# EAGLE design control (EAGLE 9.5.1)
COMPANY: PepeTech; CREVISION: V1.0; DESIGNER: Rafael Silva; LICENSE: Licensed under GNU General Public License v3.0; LINK: https://github.com/pepetech/r3eflow-oven
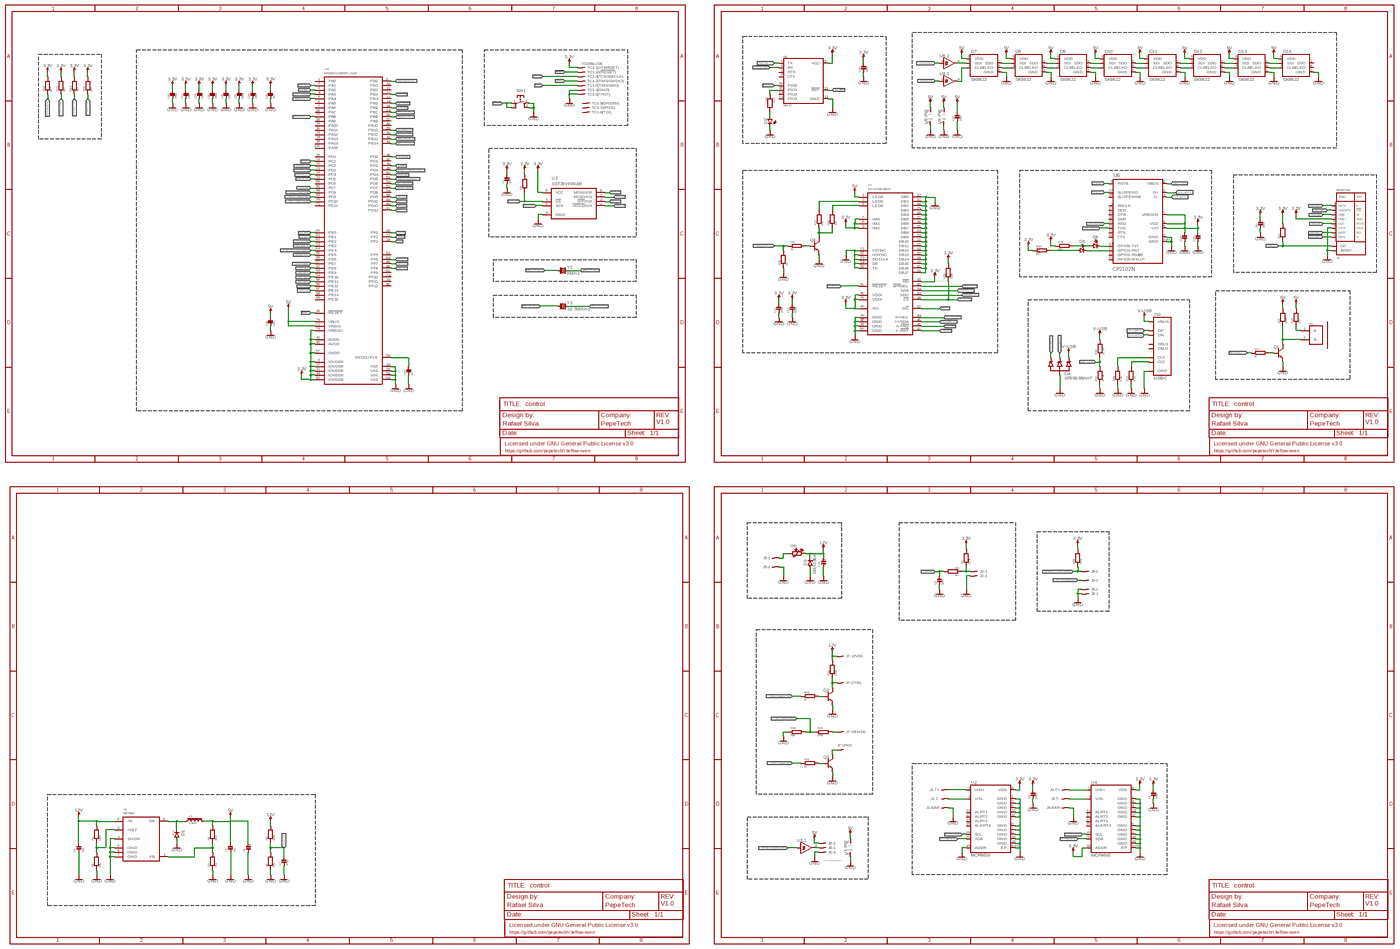
[diagram p0: schematic, sheet 1, overview]
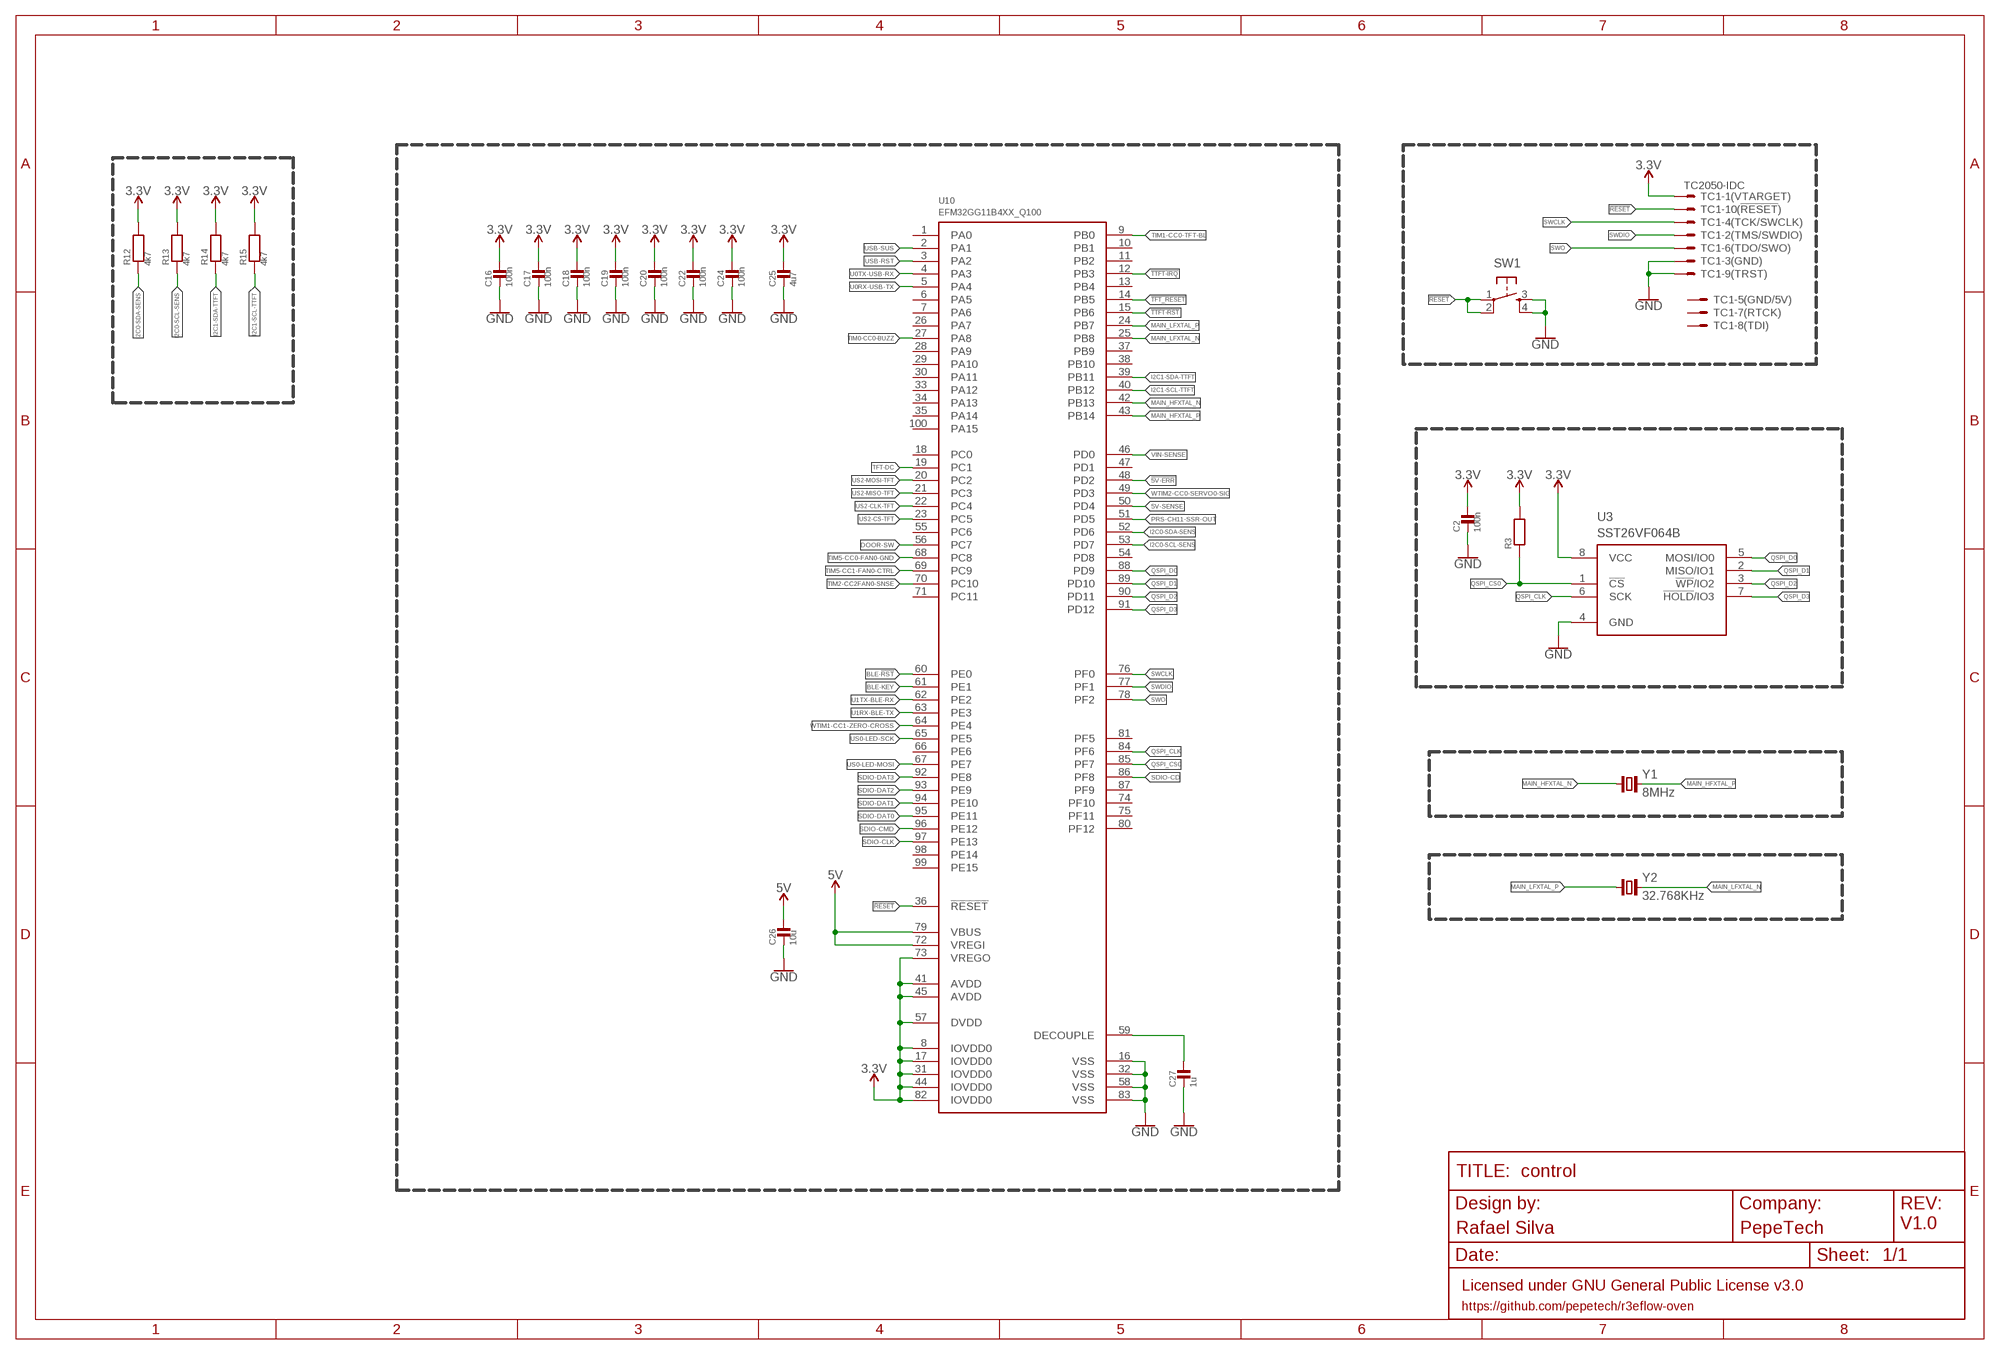
[diagram p1: schematic, sheet 1, part 1 of 4]
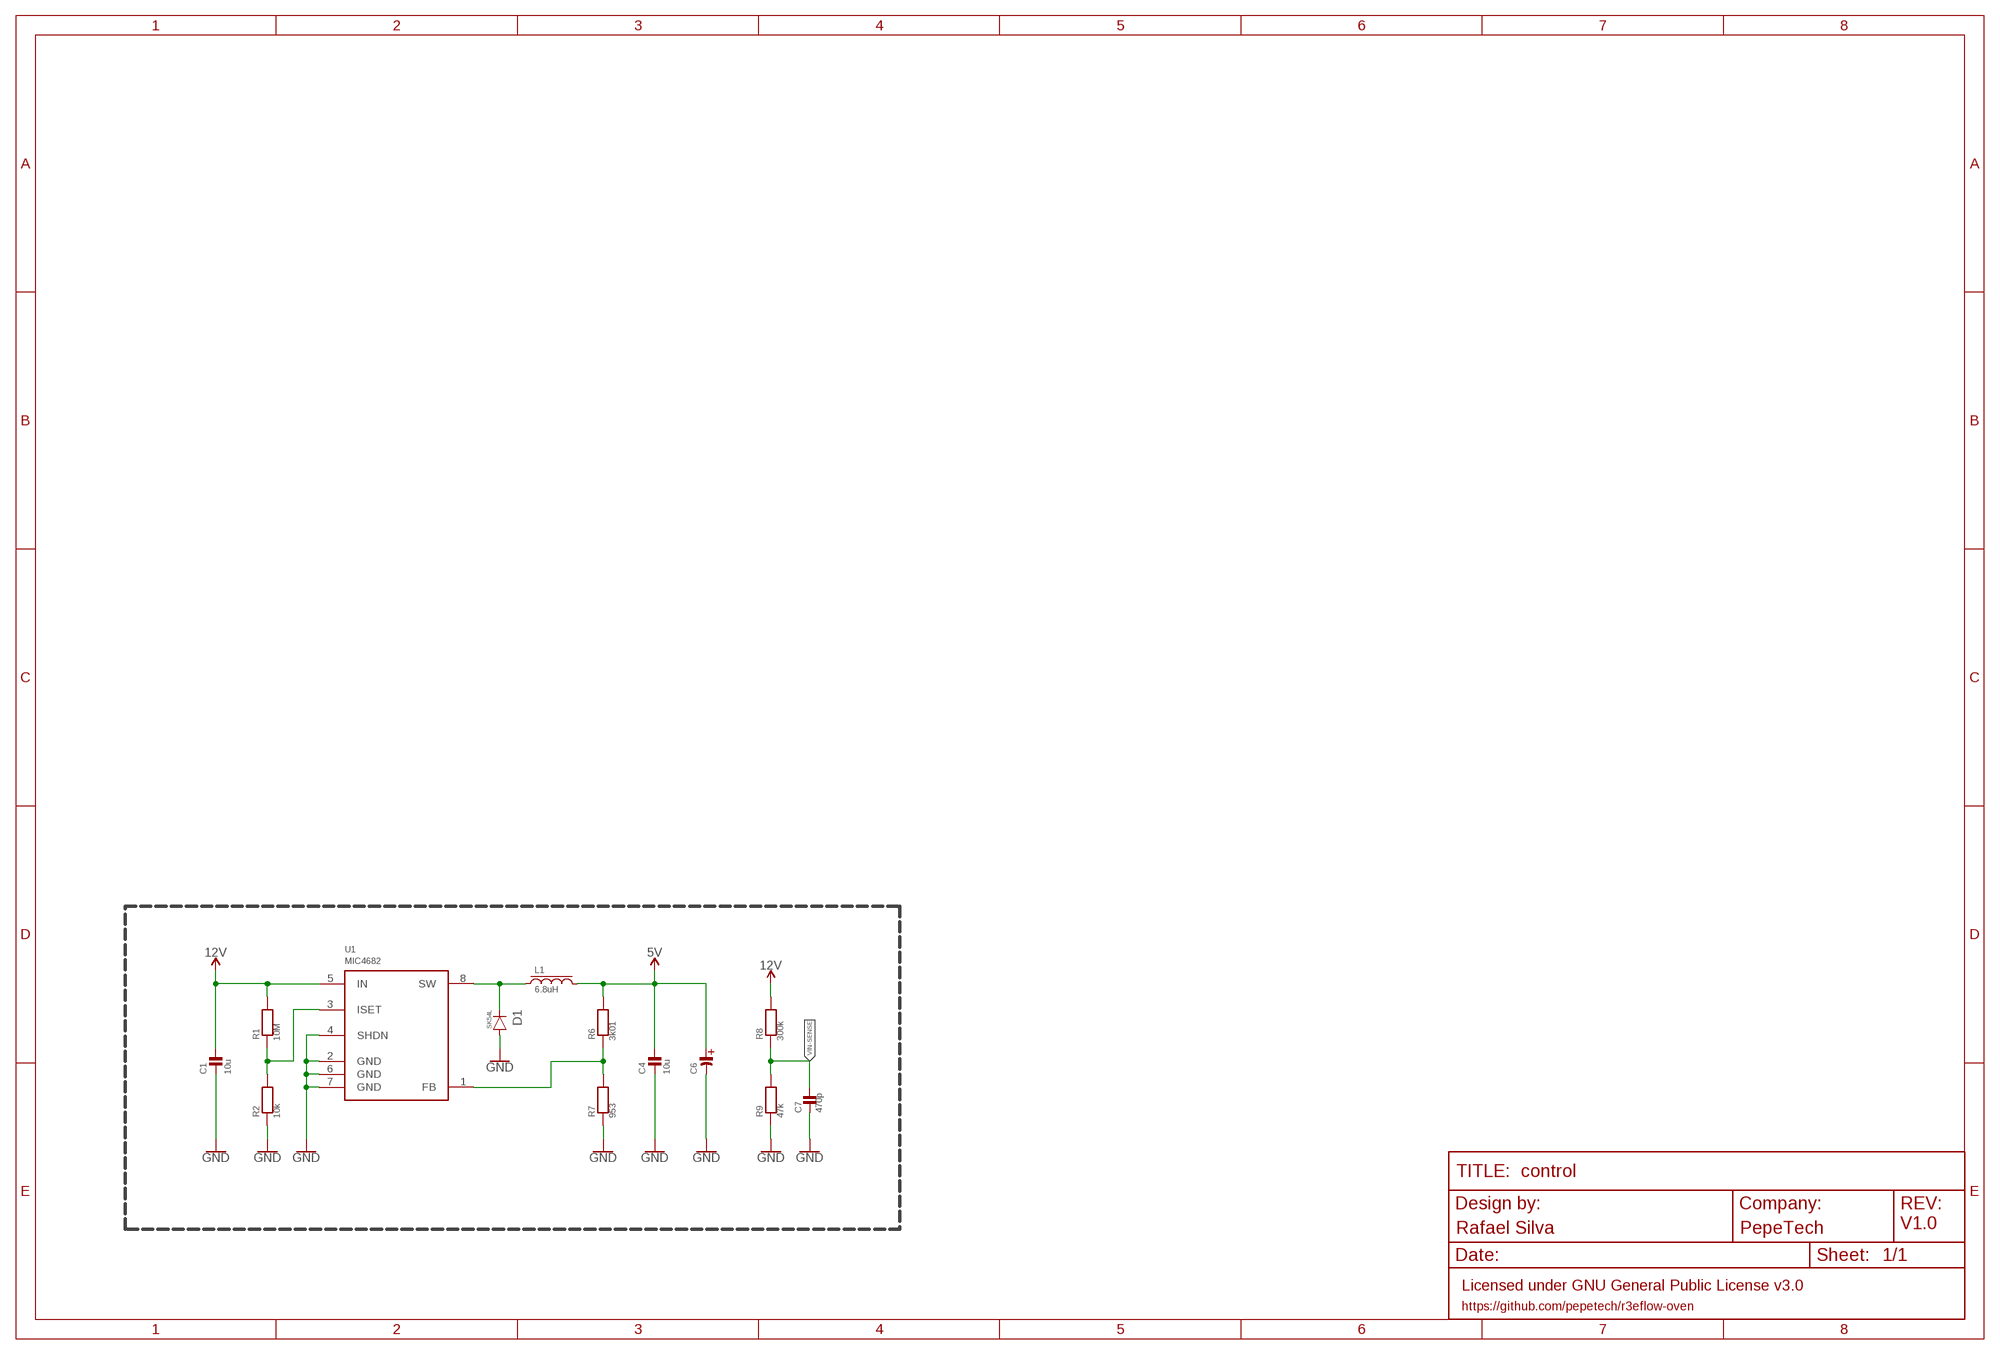
[diagram p2: schematic, sheet 1, part 2 of 4]
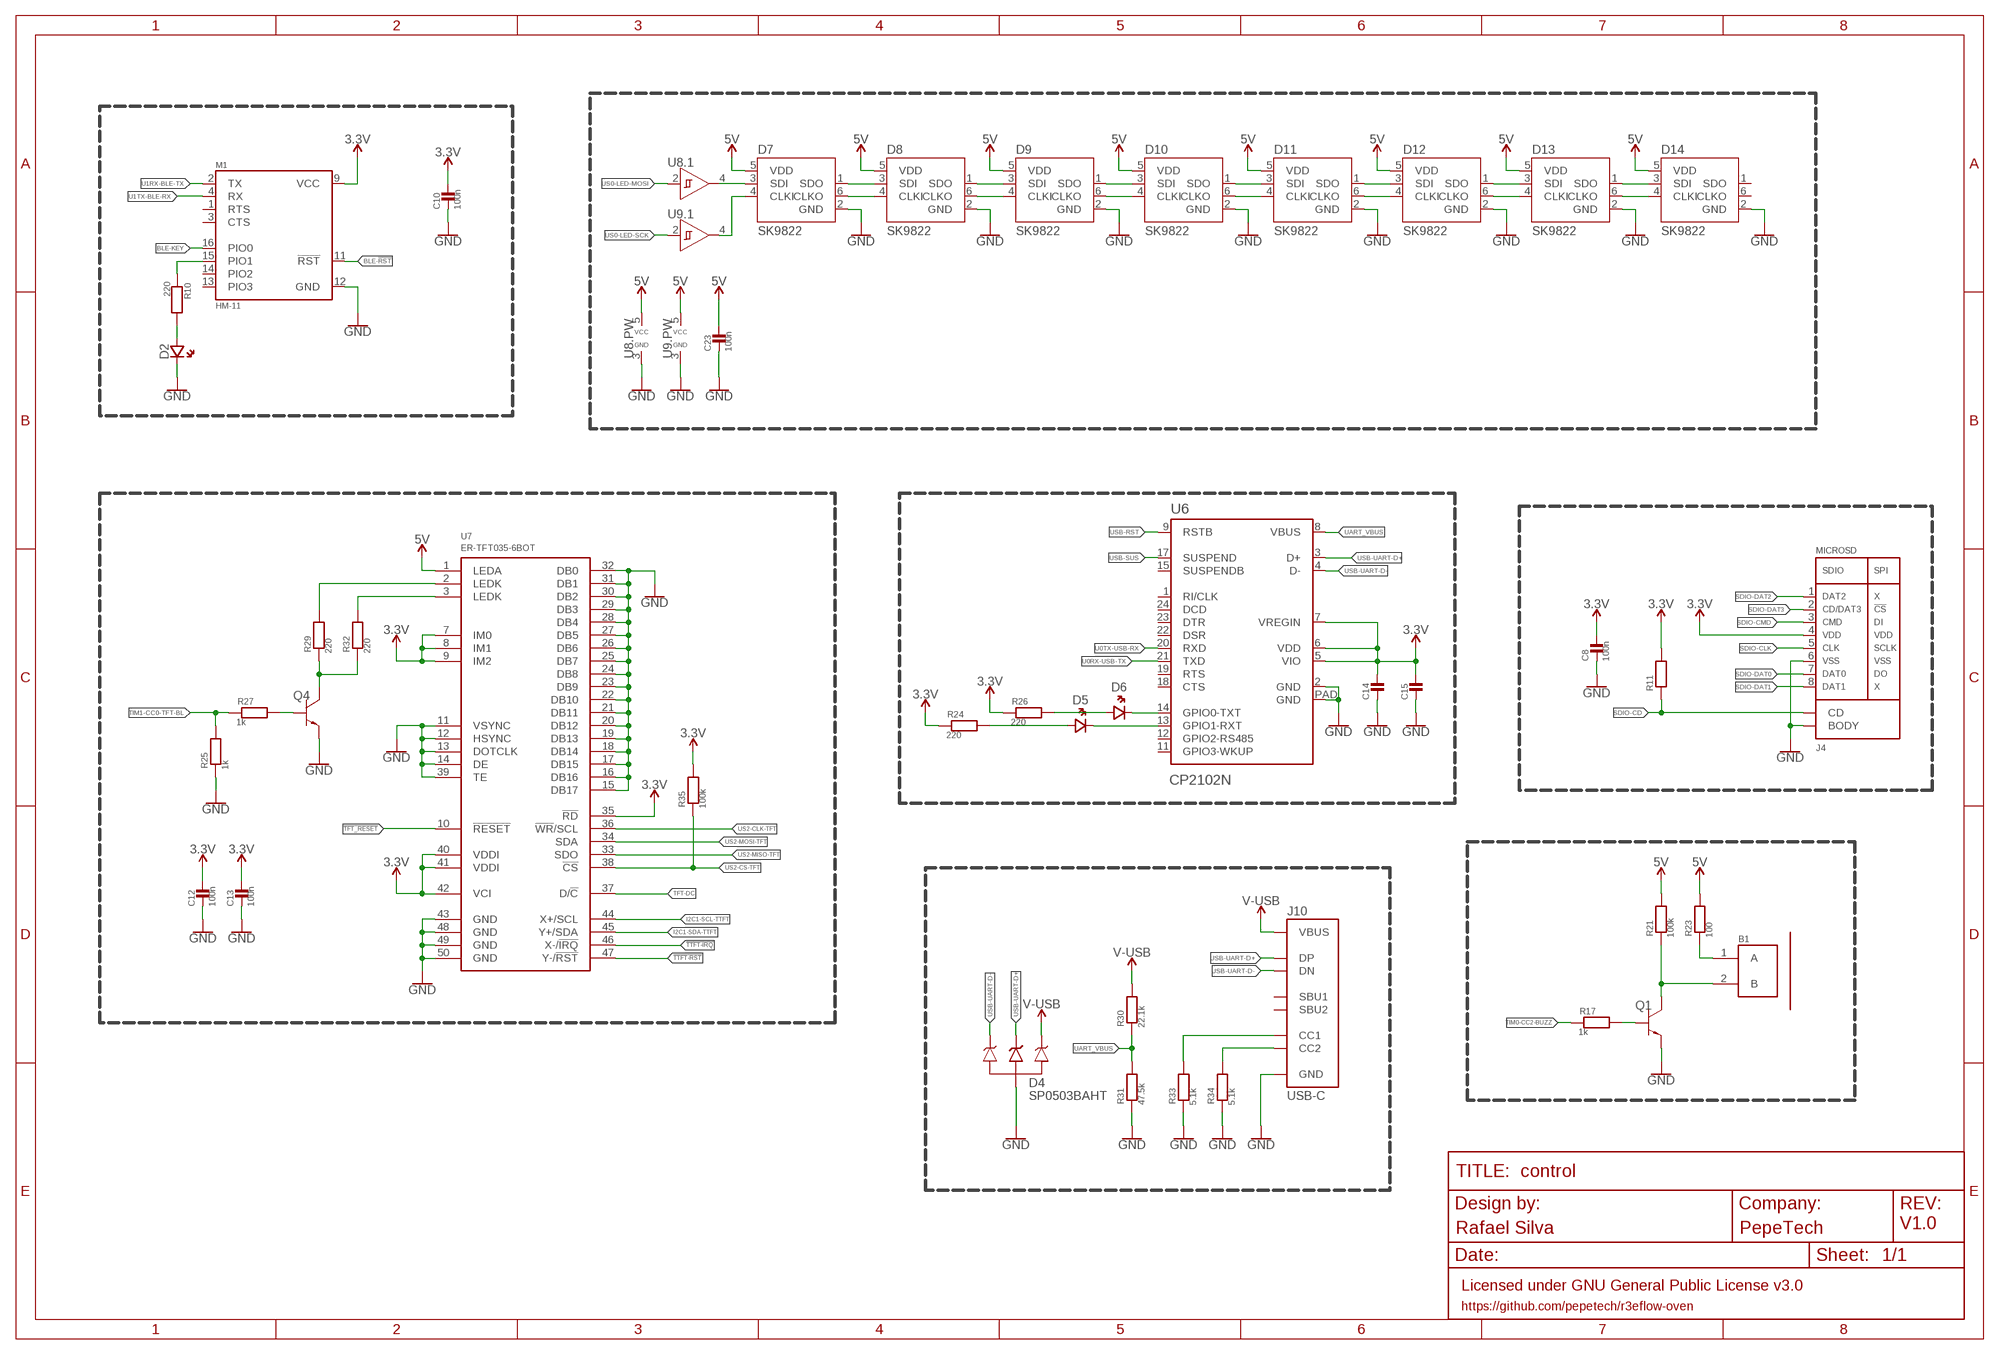
[diagram p3: schematic, sheet 1, part 3 of 4]
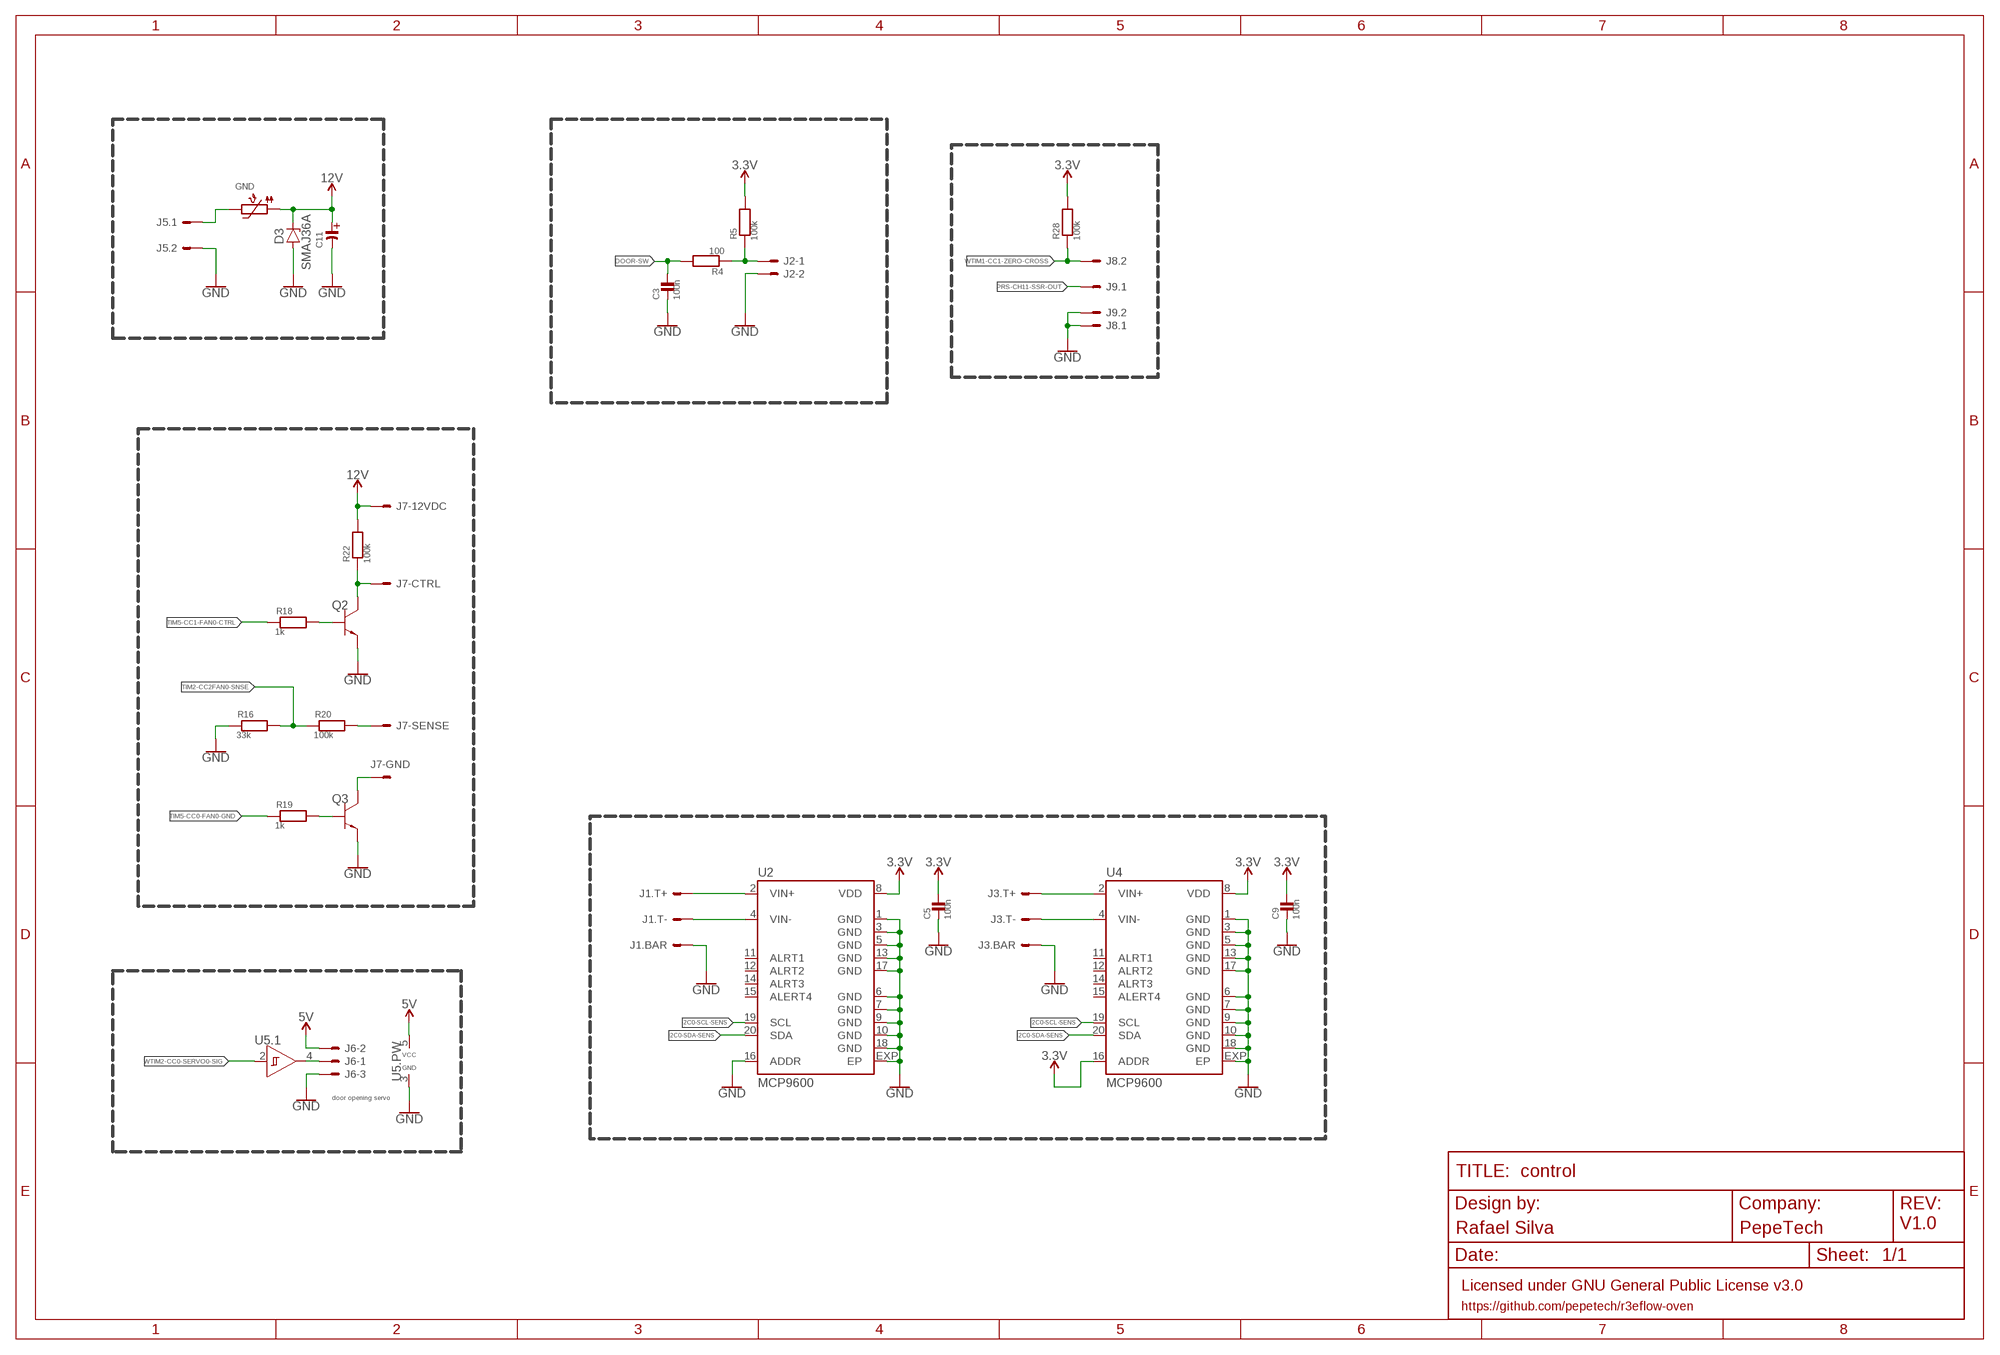
[diagram p4: schematic, sheet 1, part 4 of 4]

## Parts
B1  PKLCS1212E2400-R1  [BUZZ_PIEZO_SMD]
C1  10u  MLCC0603_MINI  [0603-MINI]
C2  100n  MLCC0603  [0603_WAVE]
C3  100n  MLCC0603  [0603_WAVE]
C4  10u  MLCC0603_MINI  [0603-MINI]
C5  100n  MLCC0603  [0603_WAVE]
C6  220u  CAPACITOR_ELD  [PANASONIC_D]
C7  470p  MLCC0603  [0603_WAVE]
C8  100n  MLCC0603  [0603_WAVE]
C9  100n  MLCC0603  [0603_WAVE]
C10  100n  MLCC0603  [0603_WAVE]
C11  CAPACITOR_ELD  [PANASONIC_D]
C12  100n  MLCC0603  [0603_WAVE]
C13  100n  MLCC0603  [0603_WAVE]
C14  MLCC0603  [0603_WAVE]
C15  MLCC0603  [0603_WAVE]
C16  100n  MLCC0603  [0603_WAVE]
C17  100n  MLCC0603  [0603_WAVE]
C18  100n  MLCC0603  [0603_WAVE]
C19  100n  MLCC0603  [0603_WAVE]
C20  100n  MLCC0603  [0603_WAVE]
C22  100n  MLCC0603  [0603_WAVE]
C23  100n  MLCC0603  [0603_WAVE]
C24  100n  MLCC0603  [0603_WAVE]
C25  4u7  MLCC0603  [0603_WAVE]
C26  10u  MLCC0603  [0603_WAVE]
C27  1u  MLCC0603  [0603_WAVE]
D1  SK54L  [DO214AA]
D2  LED0603  [CHIPLED_0603]
D3  SMAJ36A  [DO214AC]
D4  SP0503BAHT  [SOT143]
D5  LED0603  [CHIPLED_0603]
D6  LED0603  [CHIPLED_0603]
D7  SK9822  [2020]
D8  SK9822  [2020]
D9  SK9822  [2020]
D10  SK9822  [2020]
D11  SK9822  [2020]
D12  SK9822  [2020]
D13  SK9822  [2020]
D14  SK9822  [2020]
GND  PTC1812  [PTC1812]
J1  PCC-SMP  [PCC-SMP]
J2  2X1_2.54  [2X1_2.54]
J3  PCC-SMP  [PCC-SMP]
J4  MICROSD  [MICRO-SD]
J5  2EDG-2P  [2EDG-2P]
J6  3X1_2.54  [3X1_2.54]
J7  4P-PC-FAN  [KF2510-3+1P]
J8  2EDG-2P  [2EDG-2P]
J9  2EDG-2P  [2EDG-2P]
J10  USB-C  [USB-C]
L1  6.8uH  INDUCTOR_1207  [_1207]
M1  HM-11  [HM-11]
Q1  BC817-40  [SOT-23-3]
Q2  BC817-40  [SOT-23-3]
Q3  BC817-40  [SOT-23-3]
Q4  BC817-40  [SOT-23-3]
R1  10M  RESISTOR0603  [0603_WAVE]
R2  10k  RESISTOR0603  [0603_WAVE]
R3  RESISTOR0603  [0603_WAVE]
R4  100  RESISTOR0603  [0603_WAVE]
R5  100k  RESISTOR0603  [0603_WAVE]
R6  3k01  RESISTOR0603  [0603_WAVE]
R7  953  RESISTOR0603  [0603_WAVE]
R8  300k  RESISTOR0603  [0603_WAVE]
R9  47k  RESISTOR0603  [0603_WAVE]
R10  220  RESISTOR0603  [0603_WAVE]
R11  RESISTOR0603  [0603_WAVE]
R12  4k7  RESISTOR0603  [0603_WAVE]
R13  4k7  RESISTOR0603  [0603_WAVE]
R14  4k7  RESISTOR0603  [0603_WAVE]
R15  4k7  RESISTOR0603  [0603_WAVE]
R16  33k  RESISTOR0603  [0603_WAVE]
R17  1k  RESISTOR0603  [0603_WAVE]
R18  1k  RESISTOR0603  [0603_WAVE]
R19  1k  RESISTOR0603  [0603_WAVE]
R20  100k  RESISTOR0603  [0603_WAVE]
R21  100k  RESISTOR0603  [0603_WAVE]
R22  100k  RESISTOR0603  [0603_WAVE]
R23  100  RESISTOR0603  [0603_WAVE]
R24  220  RESISTOR0603  [0603_WAVE]
R25  1k  RESISTOR0603  [0603_WAVE]
R26  220  RESISTOR0603  [0603_WAVE]
R27  1k  RESISTOR0603  [0603_WAVE]
R28  100k  RESISTOR0603  [0603_WAVE]
R29  220  RESISTOR0603  [0603_WAVE]
R30  22.1k  RESISTOR0603  [0603_WAVE]
R31  47.5k  RESISTOR0603  [0603_WAVE]
R32  220  RESISTOR0603  [0603_WAVE]
R33  5.1k  RESISTOR0603  [0603_WAVE]
R34  5.1k  RESISTOR0603  [0603_WAVE]
R35  100k  RESISTOR0603  [0603_WAVE]
SW1  PUSH_BUTTON  [PUSH_BUTTON]
TC1  TC2050-IDC  [TC2050-IDC]
U1  MIC4682  [SOIC8]
U2  MCP9600  [TQFN20-5X5]
U3  SST26VF064B  [WSOIC8]
U4  MCP9600  [TQFN20-5X5]
U5  74LVC1G17  [SC70-5]
U6  CP2102N  [QFN24]
U7  ER-TFT035-6BOT  [ZIF50-TFT_BACK]
U8  74LVC1G17  [SC70-5]
U9  74LVC1G17  [SC70-5]
U10  EFM32GG11B4XX_Q100  [QFP100]
Y1  8MHz  CRYSTALNX5032GA  [2-SMD-5X3]
Y2  32.768KHz  CRYSTALCM200S  [CM200S]

## Nets
3.3V: C2.P$1 C5.P$1 C8.P$1 C9.P$1 C10.P$1 C12.P$1 C13.P$1 C14.P$1 C15.P$1 C16.P$1 C17.P$1 C18.P$1 C19.P$1 C20.P$1 C22.P$1 C24.P$1 C25.P$1 J4.4 M1.9(VCC) R3.P$2 R5.P$2 R11.P$2 R12.P$2 R13.P$2 R14.P$2 R15.P$2 R24.P$1 R26.P$1 R28.P$2 R35.P$2 TC1.1 U2.8(VDD) U3.8(VCC) U4.8(VDD) U4.16(ADDR) U6.5(VIO) U6.6(VDD) U6.7(VREGIN) U7.7(IM0) U7.8(IM1) U7.9(IM2) U7.35(!RD) U7.40(VDDI) U7.41(VDDI) U7.42(VCI) U10.8(IOVDD0) U10.17(IOVDD0) U10.31(IOVDD0) U10.41(AVDD) U10.44(IOVDD0) U10.45(AVDD) U10.57(DVDD) U10.73(VREGO) U10.82(IOVDD0)
5V: C4.1 C6.+(AN) C23.P$1 C26.P$1 D7.5(VDD) D8.5(VDD) D9.5(VDD) D10.5(VDD) D11.5(VDD) D12.5(VDD) D13.5(VDD) D14.5(VDD) J6.P$2 L1.2 R6.P$2 R21.P$2 R23.P$2 U5.5(.PW:VCC) U7.1(LEDA) U8.5(.PW:VCC) U9.5(.PW:VCC) U10.72(VREGI) U10.79(VBUS)
5V-SENSE: U10.50(PD4)
12V: C1.1 C11.+(AN) D3.C GND.P$1 J7.2 R1.P$2 R8.P$2 R22.P$2 U1.5(IN)
!5V-ERR: U10.48(PD2)
!RESET: SW1.1 SW1.2 TC1.10 U10.36(!RESET)
!TFT_RESET: U7.10(!RESET) U10.14(PB5)
!TTFT-IRQ: U7.46(X-/!IRQ!) U10.12(PB3)
!TTFT-RST: U7.47(Y-/!RST!) U10.15(PB6)
BLE-!RST: M1.11(!RST!) U10.60(PE0)
BLE-KEY: M1.16(PIO0) U10.61(PE1)
DECOUPLE: C27.P$1 U10.59(DECOUPLE)
DOOR-SW: C3.P$1 R4.P$2 U10.56(PC7)
GND: C1.2 C2.P$2 C3.P$2 C4.2 C5.P$2 C6.-(CA) C7.P$2 C8.P$2 C9.P$2 C10.P$2 C11.-(CA) C12.P$2 C13.P$2 C14.P$2 C15.P$2 C16.P$2 C17.P$2 C18.P$2 C19.P$2 C20.P$2 C22.P$2 C23.P$2 C24.P$2 C25.P$2 C26.P$2 C27.P$2 D1.A D2.C(CA) D3.A D4.1 D7.2(GND) D8.2(GND) D9.2(GND) D10.2(GND) D11.2(GND) D12.2(GND) D13.2(GND) D14.2(GND) J1.3-BAR J1.4-BAR J2.2 J3.3-BAR J3.4-BAR J4.6 J4.BODY1(BODY) J4.BODY2(BODY) J4.BODY3(BODY) J4.BODY4(BODY) J5.P$2 J6.P$3 J8.P$1 J9.P$2 J10.A1_B12(GND) J10.B1_A12(GND) J10.SHIELD0(GND) J10.SHIELD1(GND) J10.SHIELD2(GND) J10.SHIELD3(GND) M1.12(GND) Q1.P$2(EM2) Q2.P$2(EM2) Q3.P$2(EM2) Q4.P$2(EM2) R2.P$1 R7.P$1 R9.P$1 R16.P$1 R25.P$1 R31.P$1 R33.P$1 R34.P$1 SW1.3 SW1.4 TC1.3 TC1.9 U1.2(GND) U1.4(SHDN) U1.6(GND) U1.7(GND) U2.1(GND) U2.3(GND) U2.5(GND) U2.6(GND) U2.7(GND) U2.9(GND) U2.10(GND) U2.13(GND) U2.16(ADDR) U2.17(GND) U2.18(GND) U2.EXP(EP) U3.4(GND) U4.1(GND) U4.3(GND) U4.5(GND) U4.6(GND) U4.7(GND) U4.9(GND) U4.10(GND) U4.13(GND) U4.17(GND) U4.18(GND) U4.EXP(EP) U5.3(.PW:GND) U6.2(GND) U6.PAD(GND) U7.11(VSYNC) U7.12(HSYNC) U7.13(DOTCLK) U7.14(DE) U7.15(DB17) U7.16(DB16) U7.17(DB15) U7.18(DB14) U7.19(DB13) U7.20(DB12) U7.21(DB11) U7.22(DB10) U7.23(DB9) U7.24(DB8) U7.25(DB7) U7.26(DB6) U7.27(DB5) U7.28(DB4) U7.29(DB3) U7.30(DB2) U7.31(DB1) U7.32(DB0) U7.39(TE) U7.43(GND) U7.48(GND) U7.49(GND) U7.50(GND) U8.3(.PW:GND) U9.3(.PW:GND) U10.16(VSS) U10.32(VSS) U10.58(VSS) U10.83(VSS)
I2C0-SCL-SENS: R13.P$1 U2.19(SCL) U4.19(SCL) U10.53(PD7)
I2C0-SDA-SENS: R12.P$1 U2.20(SDA) U4.20(SDA) U10.52(PD6)
I2C1-SCL-TTFT: R15.P$1 U7.44(X+/SCL) U10.40(PB12)
I2C1-SDA-TTFT: R14.P$1 U7.45(Y+/SDA) U10.39(PB11)
MAIN_HFXTAL_N: U10.42(PB13) Y1.1
MAIN_HFXTAL_P: U10.43(PB14) Y1.2
MAIN_LFXTAL_N: U10.25(PB8) Y2.4
MAIN_LFXTAL_P: U10.24(PB7) Y2.1
N$1: J2.1 R4.P$1 R5.P$1
N$2: J6.P$1 U5.4(.1:Y)
N$3: J10.B5(CC2) R34.P$2
N$4: B1.1(A) R23.P$1
N$5: J10.A5(CC1) R33.P$2
N$6: D7.1(SDO) D8.3(SDI)
N$7: D7.4(CLKI) U9.4(.1:Y)
N$8: D7.3(SDI) U8.4(.1:Y)
N$9: D7.6(CLKO) D8.4(CLKI)
N$10: D8.1(SDO) D9.3(SDI)
N$11: D8.6(CLKO) D9.4(CLKI)
N$12: D9.1(SDO) D10.3(SDI)
N$13: D5.C(CA) U6.13(GPIO1-RXT)
N$14: D9.6(CLKO) D10.4(CLKI)
N$15: D6.C(CA) U6.14(GPIO0-TXT)
N$16: D6.A(AN) R26.P$2
N$17: B1.2(B) Q1.P$3(C03) R21.P$1
N$18: Q1.P$1(BA1) R17.P$2
N$19: D5.A(AN) R24.P$2
N$20: D10.1(SDO) D11.3(SDI)
N$21: D10.6(CLKO) D11.4(CLKI)
N$22: D11.1(SDO) D12.3(SDI)
N$23: D11.6(CLKO) D12.4(CLKI)
N$24: D12.1(SDO) D13.3(SDI)
N$25: Q4.P$1(BA1) R27.P$2
N$26: D12.6(CLKO) D13.4(CLKI)
N$27: D13.1(SDO) D14.3(SDI)
N$28: D13.6(CLKO) D14.4(CLKI)
N$30: GND.P$2 J5.P$1
N$31: D1.C L1.1 U1.8(SW)
N$32: R6.P$1 R7.P$2 U1.1(FB)
N$34: R1.P$1 R2.P$2 U1.3(ISET)
N$35: D2.A(AN) R10.P$2
N$36: M1.15(PIO1) R10.P$1
N$56: Q3.P$1(BA1) R19.P$2
N$57: J7.1 Q3.P$3(C03)
N$58: Q2.P$1(BA1) R18.P$2
N$59: J7.4 Q2.P$3(C03) R22.P$1
N$64: J7.3 R20.P$2
PRS-CH11-SSR-OUT: J9.P$1 U10.51(PD5)
QSPI_CLK: U3.6(SCK) U10.84(PF6)
QSPI_CS0: R3.P$1 U3.1(!CS!) U10.85(PF7)
QSPI_D0: U3.5(MOSI/IO0) U10.88(PD9)
QSPI_D1: U3.2(MISO/IO1) U10.89(PD10)
QSPI_D2: U3.3(!WP!/IO2) U10.90(PD11)
QSPI_D3: U3.7(!HOLD!/IO3) U10.91(PD12)
SDIO-CD: J4.9(CD) R11.P$1 U10.86(PF8)
SDIO-CLK: J4.5 U10.97(PE13)
SDIO-CMD: J4.3 U10.96(PE12)
SDIO-DAT0: J4.7 U10.95(PE11)
SDIO-DAT1: J4.8 U10.94(PE10)
SDIO-DAT2: J4.1 U10.93(PE9)
SDIO-DAT3: J4.2 U10.92(PE8)
SWCLK: TC1.4 U10.76(PF0)
SWDIO: TC1.2 U10.77(PF1)
SWO: TC1.6 U10.78(PF2)
TC_VIN0+: J1.1-T+ U2.2(VIN+)
TC_VIN0-: J1.2-T- U2.4(VIN-)
TC_VIN1+: J3.1-T+ U4.2(VIN+)
TC_VIN1-: J3.2-T- U4.4(VIN-)
TFT-DC: U7.37(D/!C!) U10.19(PC1)
TFT-LEDK: Q4.P$3(C03) R29.P$1 R32.P$1
TFT-LEDK1: R29.P$2 U7.2(LEDK)
TFT-LEDK2: R32.P$2 U7.3(LEDK)
TIM0-CC0-BUZZ: U10.27(PA8)
TIM0-CC2-BUZZ: R17.P$1
TIM1-CC0-TFT-BL: R25.P$2 R27.P$1 U10.9(PB0)
TIM2-CC2FAN0-SNSE: R16.P$2 R20.P$1 U10.70(PC10)
TIM5-CC0-FAN0-GND: R19.P$1 U10.68(PC8)
TIM5-CC1-FAN0-CTRL: R18.P$1 U10.69(PC9)
U0RX-USB-TX: U6.21(TXD) U10.5(PA4)
U0TX-USB-RX: U6.20(RXD) U10.4(PA3)
U1RX-BLE-TX: M1.2(TX) U10.63(PE3)
U1TX-BLE-RX: M1.4(RX) U10.62(PE2)
UART_VBUS: R30.P$1 R31.P$2 U6.8(VBUS)
US0-LED-MOSI: U8.2(.1:A) U10.67(PE7)
US0-LED-SCK: U9.2(.1:A) U10.65(PE5)
US2-CLK-TFT: U7.36(!WR!/SCL) U10.22(PC4)
US2-CS-TFT: R35.P$1 U7.38(!CS) U10.23(PC5)
US2-MISO-TFT: U7.33(SDO) U10.21(PC3)
US2-MOSI-TFT: U7.34(SDA) U10.20(PC2)
USB-RST: U6.9(RSTB) U10.3(PA2)
USB-SUS: U6.17(SUSPEND) U10.2(PA1)
USB-UART-D+: D4.3 J10.A6(DP) J10.B6(DP) U6.3(D+)
USB-UART-D-: D4.2 J10.A7(DN) J10.B7(DN) U6.4(D-)
V_USB: D4.4 J10.A4_B9(VBUS) J10.B4_A9(VBUS) R30.P$2 ; supply symbol labelled V-USB
VIN-SENSE: C7.P$1 R8.P$1 R9.P$2 U10.46(PD0)
WTIM1-CC1-ZERO-CROSS: J8.P$2 R28.P$1 U10.64(PE4)
WTIM2-CC0-SERVO0-SIG: U5.2(.1:A) U10.49(PD3)
Unconnected: D14.1(SDO) D14.6(CLKO) J10.A8(SBU1) J10.B8(SBU2) M1.1(RTS) M1.3(CTS) M1.13(PIO3) M1.14(PIO2) TC1.5 TC1.7 TC1.8 U2.11(ALRT1) U2.12(ALRT2) U2.14(ALRT3) U2.15(ALERT4) U4.11(ALRT1) U4.12(ALRT2) U4.14(ALRT3) U4.15(ALERT4) U6.1(RI/CLK) U6.11(GPIO3-WKUP) U6.12(GPIO2-RS485) U6.15(SUSPENDB) U6.18(CTS) U6.19(RTS) U6.22(DSR) U6.23(DTR) U6.24(DCD) U10.1(PA0) U10.6(PA5) U10.7(PA6) U10.10(PB1) U10.11(PB2) U10.13(PB4) U10.18(PC0) U10.26(PA7) U10.28(PA9) U10.29(PA10) U10.30(PA11) U10.33(PA12) U10.34(PA13) U10.35(PA14) U10.37(PB9) U10.38(PB10) U10.47(PD1) U10.54(PD8) U10.55(PC6) U10.66(PE6) U10.71(PC11) U10.74(PF10) U10.75(PF11) U10.80(PF12) U10.81(PF5) U10.87(PF9) U10.98(PE14) U10.99(PE15) U10.100(PA15)

## Notes on the sheet
- door opening servo

## Library data of the parts
B1 = Eletromechanical > Buzzer:PKLCS1212E2400-R1
C1-C5 C7-C10 C12-C20 C22-C27 = Passive Components > Capacitors > Multilayer Ceramic Capacitors MLCC:MLCC: KEMET’s X7R dielectric features a 125°C maximum operating temperature and is considered temperature stable. The Electronics Components, Assemblies and Materials Association (EIA) characterizes X7R dielectric as a Class II material. Components of this classification are fixed, ceramic dielectric capacitors suited for bypass and decoupling applications or for frequency discriminating circuits where Q and stability of capacitance characteristics are not critical. X7R exhibits a predictable change in capacitance with respect to time and voltage, boasting a minimal change in capacitance with reference to ambient temperature. Capacitance change is limited to ±15% from −55°C to +125°C.
C6 C11 = Passive Components > Capacitors > Aluminium Electrolytic Capacitors:CAPACITOR_EL
D1 = Semiconductors > Discrete Semiconductors > Diodes & Rectifiers > Schottky Diodes & Rectifiers:SK54L
D2 D5 D6 = Opto-electronics > LED Emitters:LED: LED 0603 - 0603 Surface Mount Package 2mA: Green LED - Low Power (3.9mcd, 2ma, 1.7Vf) - Digikey: 475-2709-2-ND Orange LED - Low Power (9.8mcd, 2ma, 1.8Vf) - Digikey: 475-1194-2-ND Red LED - Low Power (5mcd, 2ma, 1.8Vf) - Digikey: 475-1195-2-ND Yellow LED - Low Power (7mcd, 2ma, 1.8Vf) - Digikey: 475-1196-2-ND 5mA: Blue LED - Low Power (17mcd, 5ma, 2.9Vf) - Digikey: LNJ937W8CRACT-ND 0805 - 0805 Surface Mount Package 2mA: Red LED (8.8mcd, 2mA, 1.8Vf, Clear) - Low Power [Digikey: 475-2510-1-ND] Green LED (5mcd, 2mA, 1.8Vf, Clear) - Low Power [Digikey: 475-2730-1-ND] Yellow LED (11.3mcd, 2mA, 1.8Vf, Clear) - Low Power [Digikey: 475-2555-1-ND] 20mA: Red LED (104mcd, 20mA, Diffused) - LS R976 [Digikey: 475-1278-6-ND] Red LED (12mcd, 20mA, 2.0Vf, Clear) - APT2012EC [Digikey: 754-1128-1-ND] Green LED (15mcd, 20mA, 2.2Vf, Clear) - APT2012GC [Digikey: 754-1131-1-ND] Orange LED (160mcd, 20mA, 2.1Vf, Clear) - APT2012SECK [Digikey: 754-1130-1-ND] 1206 - 1206 Surface Mount Package Green LED (26mcd, 20mA, Diffused) - LG N971 [Digikey: 475-1407-6-ND] Red LED (15mcd, 20mA, Diffused) - LH N974 [Digikey: 475-1416-6-ND] Cree - Cree High-Power Surface Mount LEDs XPEBWT-L1-0000-00D50 - White 111lm 350mA 2.9Vf 6200K 110° XTEAWT-00-0000-00000LEE3 - White 114lm 350mA 2.85Vf 5000K 115° Everlight - Everlight 45-21 Series Surface Mount LEDs 45-21/QK2C-B2832AC2CB2/2T - Warm White 2000mcd 20mA 3.25Vf 3050K 120° 45-21/LK2C-B38452C4CB2/2T - Nuetral White 2000mcd 20mA 3.25Vf 4150K 120° 45-21/LK2C-B50634C6CB2/2T - Cold White 2200mcd 20mA 3.25Vf 5650K 120° PLCC2 Reverse Mount LS T77K-J1L2-1-0-2-R18-Z - Red 11.25mcd 2mA 1.8Vf 630nm 120° LO T77K-L1M2-24-Z - Orange 19.6mcd 2mA 1.8Vf 606nm 120° LY T77K-K2M1-26-Z - Yellow 15.7mcd 2mA 1.8Vf 587nm 120°
D3 = Circuit Protection > ESD Suppressors \ TVS Diodes:SMAJ36A
D4 = Circuit Protection > ESD Suppressors \ TVS Diodes:SP0503BAHT
D7-D14 = Opto-electronics > LED Emitters:SK9822
GND = Circuit Protection > Resettable Fuses - PPTC:PTC
J1 J3 = Connectors > Other:PCC-SMP
J2 = Connectors > Header:2X1_2.54
J4 = Connectors > card socket:MICROSD
J5 J8 J9 = Connectors > Other:2EDG-2P
J6 = Connectors > Header:3X1_2.54
J7 = Thermal Management > Fans & Blowers:4P-PC-FAN
J10 = Connectors > USB:USB-C
L1 = Passive Components > Inductors, Chokes & Coils:INDUCTOR
M1 = Embedded > BLE Module:HM-11
Q1-Q4 = Semiconductors > Discrete Semiconductors > Transistors > Bipolar Transistors - BJT:BC817-40
R1-R35 = Passive Components > Resistors > Chip Resistors:RESISTOR: Resistors For new designs, use the packages preceded by an '_' character since they are more reliable: The following footprints should be used on most boards: _0402 - Standard footprint for regular board layouts _0603 - Standard footprint for regular board layouts _0805 - Standard footprint for regular board layouts _1206 - Standard footprint for regular board layouts For extremely tight-pitch boards where space is at a premium, the following 'micro-pitch' footprints can be used (smaller pads, no silkscreen outline, etc.): _0402MP - Micro-pitch footprint for very dense/compact boards _0603MP - Micro-pitch footprint for very dense/compact boards _0805MP - Micro-pitch footprint for very dense/compact boards _1206MP - Micro-pitch footprint for very dense/compact boards
SW1 = Eletromechanical > Switches > Tactile Switches:PUSH_BUTTON
TC1 = Connectors > Other:TC2050-IDC
U1 = Power > Switching Controllers:MIC4682
U2 U4 = Sensors > Temperature Sensors:MCP9600
U3 = Semiconductors > Integrated Circuits - ICs > Memory ICs > Flash:SST26VF064B
U5 U8 U9 = Semiconductors > Integrated Circuits - ICs > Logic ICs > Logic Gates:74LVC1G17
U6 = Semiconductors > Integrated Circuits - ICs > Interface ICs > USB Interface IC:CP2102N
U7 = Opto-electronics > Displays:ER-TFT035-6
U10 = Semiconductors > Embedded Processors & Controllers > Microcontrollers - MCU:EFM32GG11B4XX_Q100
Y1 Y2 = Passive Components > Frequency Control & Timing Devices > Crystals:CRYSTAL: Citizen CM200S & CM250S Series

## Board
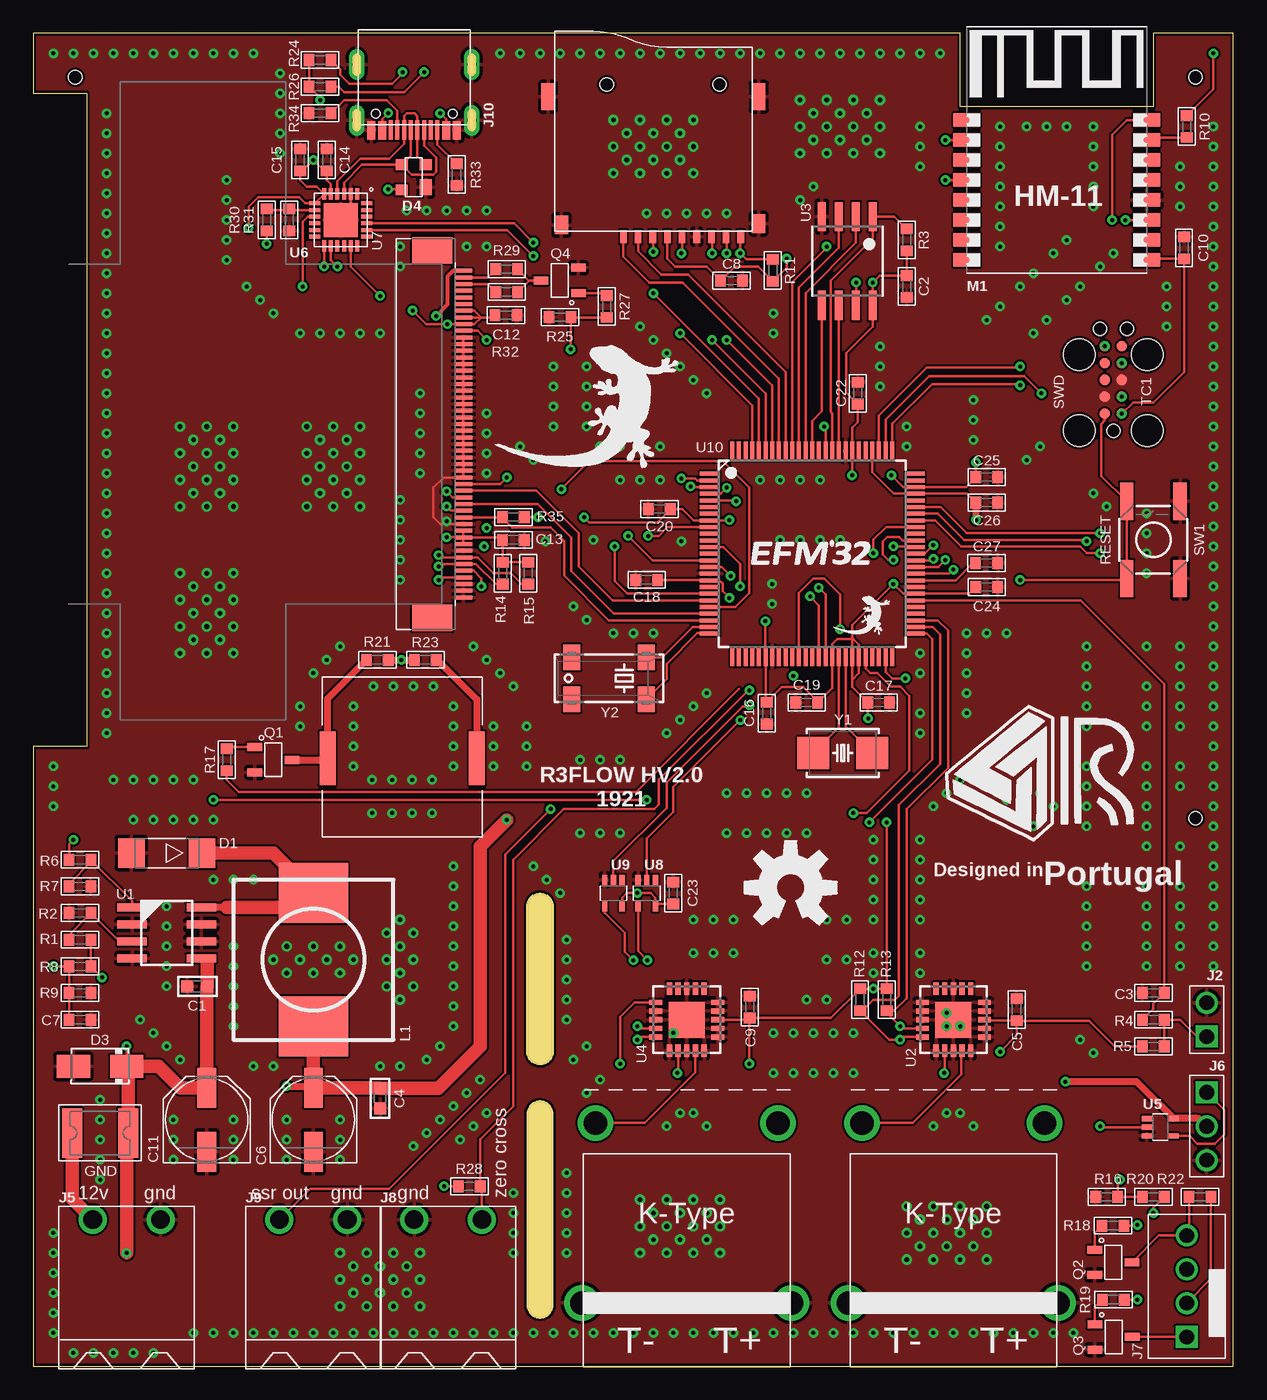
[diagram p5: board, top side]
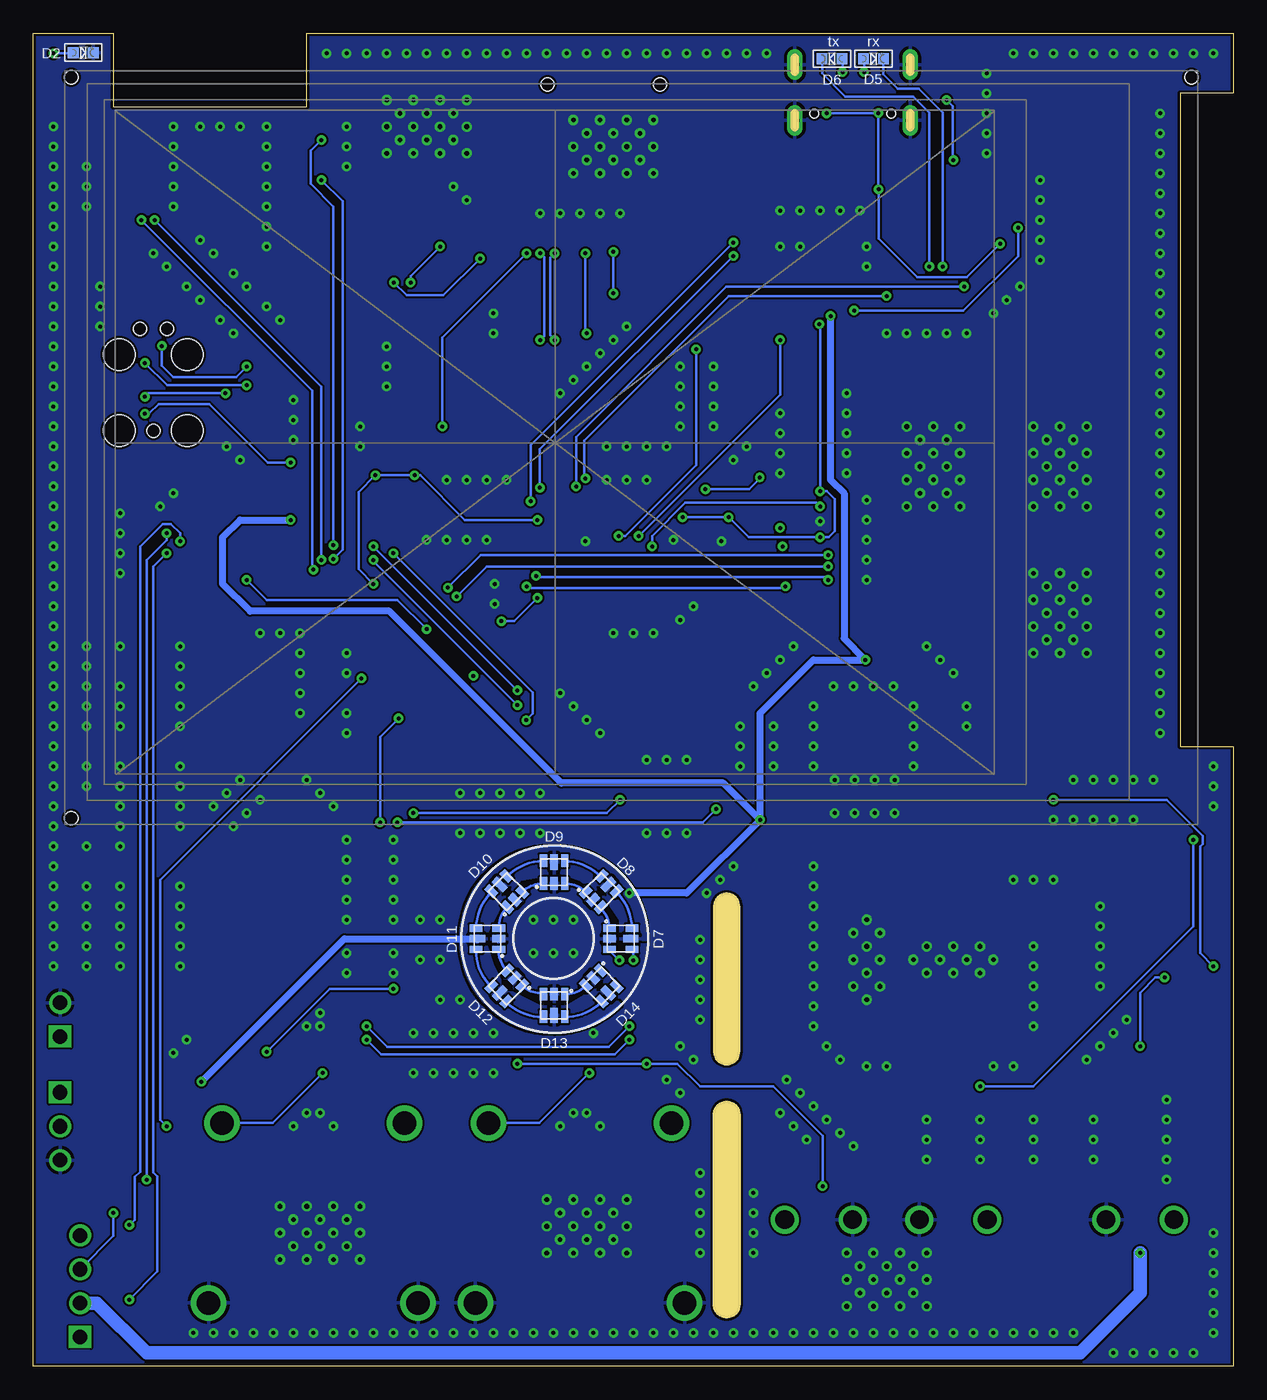
[diagram p6: board, bottom side, seen from below]

Size 90 x 100 mm. Coordinates in mm from the lower left corner, seen from the top.
Outline: 38,35.5 arc-90 39,34.5 39,23.6 arc-90 38,22.6 arc-90 37,23.6 37,34.5 arc-90 38,35.5
Outline: 38,3.6 arc90 39,4.6 39,18.9 arc90 38,19.9 arc90 37,18.9 37,4.6 arc90 38,3.6
Outline: 0,0 90,0 90,100 84,100 84,94.5 69.5,94.5 69.5,100 0,100 0,95.5 4,95.5 4,46.5 0,46.5 0,0
Copper layers (1*16): Top 0.035mm / dielectric 1.6mm / Bottom 0.035mm
Design rules "jlcpcb-dr *": minimum track width 0.2mm, minimum drill 0.3mm, track to track 6mil, track to pad 6mil, pad to pad 6mil, via to via 6mil, smd to smd 6mil, copper to edge 0.2mm, drill to drill 5mil, minimum pad ring 10mil, minimum via ring 8mil, stop-mask expansion 4mil, vias tented up to drill 0.7mm, thermal gap 10mil
Milling: 2 lines

### Footprints (pad centres in the part's own frame; a part is rotated, then mirrored left to right if it is on the bottom)
BUZZ_PIEZO_SMD = smd 1.2 x 4: 1 -5.6,0.1; 2 5.6,0.1
0603-MINI = smd 0.9 x 0.9: 1 -0.75,0; 2 0.75,0
0603_WAVE = smd 0.8 x 0.9: P$1 -0.823,0; P$2 0.823,0
PANASONIC_D = smd 3 x 1.4: + 2.4,0; - -2.4,0
DO214AA = smd 2 x 2.2: A 2.65,0; C -2.65,0
CHIPLED_0603 = smd 0.8 x 0.8: A 0,-0.75; C 0,0.75
DO214AC = smd 2.5 x 1.7: A 2,0; C -2,0
SOT143 = smd 1.2 x 0.9: 1 -0.711,-0.889 | smd 0.8 x 0.9: 2 0.989,-0.889; 3 0.989,0.911; 4 -0.911,0.911
2020 = smd 0.95 x 0.55: 1 -0.85,0.8; 2 -0.85,0; 3 -0.85,-0.8; 4 0.85,-0.8; 6 0.85,0.8 | smd 1.15 x 0.55: 5 0.75,0
PTC1812 = smd 1.5 x 3.7: P$1 -2.1,0; P$2 2.1,0
PCC-SMP = drill 1.77: 1-T+ -6.85,-6.75; 2-T- 6.85,-6.75; 3-BAR 7.85,6.75; 4-BAR -7.85,6.75
2X1_2.54 = drill 1.1 square: 1 -1.27,0 | drill 1.1: 2 1.27,0
MICRO-SD = smd 0.5 x 1: 1 2.25,6.75; 2 1.15,6.75; 3 0.05,6.75; 4 -1.05,6.75; 5 -2.15,6.75; 6 -3.25,6.75; 7 -4.35,6.75; 8 -5.45,6.75; 9 -6.55,6.75 | smd 1 x 1.4: BODY1 -7.89,5.78; BODY4 6.89,5.88 | smd 1 x 2: BODY2 -7.9,-3.75; BODY3 7.9,-3.75 | hole 1: -4.95,-4.65; 3.5,-4.65
2EDG-2P = drill 1.4: P$1 -2.54,0; P$2 2.54,0
3X1_2.54 = drill 1.1 square: P$1 -2.54,0 | drill 1.1: P$2 0,0; P$3 2.54,0
KF2510-3+1P = drill 1.1 square: 1 -3.81,0 | drill 1.1: 2 -1.27,0; 3 1.27,0; 4 3.81,0
USB-C = smd 0.6 x 1.4: A1_B12 -3.2,7.276; A4_B9 -2.4,7.276; B1_A12 3.2,7.276; B4_A9 2.4,7.276 | smd 0.3 x 1.45: A5 -1.75,7.251; A6 -0.75,7.251; A7 0.75,7.251; A8 1.75,7.251; B5 1.27,7.251; B6 0.25,7.251; B7 -0.25,7.251; B8 -1.25,7.251 | drill 0.65 pad 1 long: SHIELD0 -4.32,6.526; SHIELD1 -4.32,2.346; SHIELD2 4.32,2.346; SHIELD3 4.32,6.526 | hole 0.65: -2.89,6.026; 2.89,6.026
_1207 = smd 4.5 x 5.2: 1 -5,0; 2 5,0
HM-11 = smd 2 x 1: 1 0,10.5; 2 0,9; 3 0,7.5; 4 0,6; 5 0,4.5; 6 0,3; 7 0,1.5; 8 0,0; 9 13.5,0; 10 13.5,1.5; 11 13.5,3; 12 13.5,4.5; 13 13.5,6; 14 13.5,7.5; 15 13.5,9; 16 13.5,10.5
SOT-23-3 = smd 0.6 x 1.1: P$1 -0.95,-1.4; P$2 0.95,-1.4; P$3 0,1.4
PUSH_BUTTON = smd 2.8 x 1: 1 -2.9,2; 2 2.9,2; 3 -2.9,-2; 4 2.9,-2
TC2050-IDC = smd 0.787 x 0.787: 1 -2.54,-0.635; 2 -1.27,-0.635; 3 0,-0.635; 4 1.27,-0.635; 5 2.54,-0.635; 6 2.54,0.635; 7 1.27,0.635; 8 0,0.635; 9 -1.27,0.635; 10 -2.54,0.635 | hole 0.991: -3.81,0; 3.81,1.016; 3.81,-1.016 | hole 2.375: -3.81,2.54; -3.81,-2.54; 1.905,2.54; 1.905,-2.54
SOIC8 = smd 0.6 x 2.2: 1 -1.905,-2.6; 2 -0.635,-2.6; 3 0.635,-2.6; 4 1.905,-2.6; 5 1.905,2.6; 6 0.635,2.6; 7 -0.635,2.6; 8 -1.905,2.6
TQFN20-5X5 = smd 0.95 x 0.4: 1 -2.325,1.3; 2 -2.325,0.65; 3 -2.325,0; 4 -2.325,-0.65; 5 -2.325,-1.3; 11 2.325,-1.3; 12 2.325,-0.65; 13 2.325,0; 14 2.325,0.65; 15 2.325,1.3 | smd 0.4 x 0.95: 6 -1.3,-2.325; 7 -0.65,-2.325; 8 0,-2.325; 9 0.65,-2.325; 10 1.3,-2.325; 16 1.3,2.325; 17 0.65,2.325; 18 0,2.325; 19 -0.65,2.325; 20 -1.3,2.325 | smd 2.7 x 2.7: EXP 0,0
WSOIC8 = smd 0.6 x 2.2: 1 -1.905,-3.33; 2 -0.635,-3.33; 3 0.635,-3.33; 4 1.905,-3.33; 5 1.905,3.33; 6 0.635,3.33; 7 -0.635,3.33; 8 -1.905,3.33
SC70-5 = smd 0.4 x 0.75: 1 -0.65,-1; 2 0,-1; 3 0.65,-1; 4 0.65,1; 5 -0.65,1
QFN24 = smd 0.3 x 0.85: 1 -1.25,-1.95; 2 -0.75,-1.95; 3 -0.25,-1.95; 4 0.25,-1.95; 5 0.75,-1.95; 6 1.25,-1.95; 13 1.25,1.95; 14 0.75,1.95; 15 0.25,1.95; 16 -0.25,1.95; 17 -0.75,1.95; 18 -1.25,1.95 | smd 0.85 x 0.3: 7 1.95,-1.25; 8 1.95,-0.75; 9 1.95,-0.25; 10 1.95,0.25; 11 1.95,0.75; 12 1.95,1.25; 19 -1.95,1.25; 20 -1.95,0.75; 21 -1.95,0.25; 22 -1.95,-0.25; 23 -1.95,-0.75; 24 -1.95,-1.25 | smd 2.55 x 2.55: PAD 0,0
ZIF50-TFT_BACK = smd 1.3 x 0.3 bottom: 1 55.369,41.54; 2 55.369,41.04; 3 55.369,40.54; 4 55.369,40.04; 5 55.369,39.54; 6 55.369,39.04; 7 55.369,38.54; 8 55.369,38.04; 9 55.369,37.54; 10 55.369,37.04; 11 55.369,36.54; 12 55.369,36.04; 13 55.369,35.54; 14 55.369,35.04; 15 55.369,34.54; 16 55.369,34.04; 17 55.369,33.54; 18 55.369,33.04; 19 55.369,32.54; 20 55.369,32.04; 21 55.369,31.54; 22 55.369,31.04; 23 55.369,30.54; 24 55.369,30.04; 25 55.369,29.54; 26 55.369,29.04; 27 55.369,28.54; 28 55.369,28.04; 29 55.369,27.54; 30 55.369,27.04; 31 55.369,26.54; 32 55.369,26.04; 33 55.369,25.54; 34 55.369,25.04; 35 55.369,24.54; 36 55.369,24.04; 37 55.369,23.54; 38 55.369,23.04; 39 55.369,22.54; 40 55.369,22.04; 41 55.369,21.54; 42 55.369,21.04; 43 55.369,20.54; 44 55.369,20.04; 45 55.369,19.54; 46 55.369,19.04; 47 55.369,18.54; 48 55.369,18.04; 49 55.369,17.54; 50 55.369,17.04 | smd 3 x 2 bottom: M1 57.694,15.5; M2 57.694,43.08 | hole 1: 0.475,56.065; 0.475,0.475; 84.485,56.065
QFP100 = smd 1.45 x 0.3: 1 -7.7,6; 2 -7.7,5.5; 3 -7.7,5; 4 -7.7,4.5; 5 -7.7,4; 6 -7.7,3.5; 7 -7.7,3; 8 -7.7,2.5; 9 -7.7,2; 10 -7.7,1.5; 11 -7.7,1; 12 -7.7,0.5; 13 -7.7,0; 14 -7.7,-0.5; 15 -7.7,-1; 16 -7.7,-1.5; 17 -7.7,-2; 18 -7.7,-2.5; 19 -7.7,-3; 20 -7.7,-3.5; 21 -7.7,-4; 22 -7.7,-4.5; 23 -7.7,-5; 24 -7.7,-5.5; 25 -7.7,-6; 51 7.7,-6; 52 7.7,-5.5; 53 7.7,-5; 54 7.7,-4.5; 55 7.7,-4; 56 7.7,-3.5; 57 7.7,-3; 58 7.7,-2.5; 59 7.7,-2; 60 7.7,-1.5; 61 7.7,-1; 62 7.7,-0.5; 63 7.7,0; 64 7.7,0.5; 65 7.7,1; 66 7.7,1.5; 67 7.7,2; 68 7.7,2.5; 69 7.7,3; 70 7.7,3.5; 71 7.7,4; 72 7.7,4.5; 73 7.7,5; 74 7.7,5.5; 75 7.7,6 | smd 0.3 x 1.45: 26 -6,-7.7; 27 -5.5,-7.7; 28 -5,-7.7; 29 -4.5,-7.7; 30 -4,-7.7; 31 -3.5,-7.7; 32 -3,-7.7; 33 -2.5,-7.7; 34 -2,-7.7; 35 -1.5,-7.7; 36 -1,-7.7; 37 -0.5,-7.7; 38 0,-7.7; 39 0.5,-7.7; 40 1,-7.7; 41 1.5,-7.7; 42 2,-7.7; 43 2.5,-7.7; 44 3,-7.7; 45 3.5,-7.7; 46 4,-7.7; 47 4.5,-7.7; 48 5,-7.7; 49 5.5,-7.7; 50 6,-7.7; 76 6,7.7; 77 5.5,7.7; 78 5,7.7; 79 4.5,7.7; 80 4,7.7; 81 3.5,7.7; 82 3,7.7; 83 2.5,7.7; 84 2,7.7; 85 1.5,7.7; 86 1,7.7; 87 0.5,7.7; 88 0,7.7; 89 -0.5,7.7; 90 -1,7.7; 91 -1.5,7.7; 92 -2,7.7; 93 -2.5,7.7; 94 -3,7.7; 95 -3.5,7.7; 96 -4,7.7; 97 -4.5,7.7; 98 -5,7.7; 99 -5.5,7.7; 100 -6,7.7
2-SMD-5X3 = smd 2.4 x 2.4: 1 -2.2,0; 2 2.2,0
CM200S = smd 1.3 x 1.9: 1 -2.794,-1.574; 2 2.794,-1.574; 3 2.794,1.574; 4 -2.794,1.574

### Placement (x,y rotation side)
B1  27.67,45.71 180 top
C1  12.3,28.5 180 top
C2  65.5,81 270 top
C3  84,28 180 top
C4  26,20.1 270 top
C5  73.74,26.76 90 top
C6  21,18.5 90 top
C7  3.5,26 0 top
C8  52.37,81.45 0 top
C9  53.74,26.95 90 top
C10  86.3,83.9 90 top
C11  13,18.5 90 top
C12  35.46,78.85 0 top
C13  36,62 0 top
C14  22,90.5 90 top
C15  20,90.5 90 top
C16  55,49 270 top
C17  63.4,49.8 0 top
C18  46,59 180 top
C19  58,49.8 180 top
C20  46.95,64.3 180 top
C22  61.83,73 90 top
C23  48,35.5 90 top
C24  71.5,58.46 0 top
C25  71.5,66.7 0 top
C26  71.5,64.8 0 top
C27  71.49,60.25 0 top
D1  10,38.5 180 top
D2  86.26,98.55 270 bottom
D3  5,22.5 180 top
D4  28.54,89.16 90 top
D5  27,98.1 270 bottom
D6  30.1,98.1 90 bottom
D7  45.95,32.07 0 bottom
D8  47.41,35.61 45 bottom
D9  50.95,37.07 90 bottom
D10  54.49,35.61 135 bottom
D11  55.95,32.07 180 bottom
D12  54.49,28.53 225 bottom
D13  50.95,27.07 270 bottom
D14  47.41,28.53 315 bottom
GND  5,17.5 180 top
J1  69,11.5 180 top
J2  88,26 90 top
J3  49,11.5 180 top
J4  46.5,91.5 180 top
J5  7,11 0 top
J6  88,18 270 top
J7  86.5,6 90 top
J8  31.1,11 0 top
J9  21,11 0 top
J10  28.56,100 180 top
L1  21,30.5 270 top
M1  70,83 0 top
Q1  18,45.5 270 top
Q2  81,7.8 270 top
Q3  81.02,2.19 270 top
Q4  39.48,81.46 90 top
R1  3.5,32 0 top
R2  3.5,34 0 top
R3  65.5,84.5 270 top
R4  84,26 180 top
R5  84,24 180 top
R6  3.5,38 180 top
R7  3.5,36 180 top
R8  3.5,30 0 top
R9  3.5,28 180 top
R10  86.5,93 90 top
R11  55.47,82.22 270 top
R12  62,27.5 90 top
R13  64,27.5 90 top
R14  35.2,59.5 90 top
R15  37.13,59.5 90 top
R16  80.5,12.7 0 top
R17  14.5,45.5 90 top
R18  80.98,10.55 180 top
R19  81,5 180 top
R20  84,12.7 0 top
R21  25.8,53 0 top
R22  87.5,12.7 0 top
R23  29.4,53 180 top
R24  21.5,98 0 top
R25  39.5,78.7 0 top
R26  21.5,96 0 top
R27  43,79.5 90 top
R28  32.7,13.5 180 top
R29  35.5,82.3 180 top
R30  17.5,86 270 top
R31  19.2,86 90 top
R32  35.5,80.6 180 top
R33  31.74,89.4 90 top
R34  21.5,94 0 top
R35  36,63.7 0 top
SW1  84,62 90 top
TC1  81,74 90 top
U1  10,32.5 270 top
U2  69,26 90 top
U3  61.05,82.91 180 top
U4  49,26 90 top
U5  84.52,17.93 270 top
U6  23.06,85.99 180 top
U7  87.63,40.64 0 bottom
U8  46,35.5 180 top
U9  43.5,35.5 180 top
U10  58.42,60.96 0 top
U$1  [DESIGNEDINPT]  75.1,36.1 0 top
U$2  [OSHW-LOGO-L]  56.8,35.9 0 top
U$3  [RAFAEL_SILVA_10MM_ALT]  68.5,39.5 0 top
U$4  [GECKO_POLY]  44.5,72 0 top
Y1  60.7,46 0 top
Y2  43.18,51.61 180 top

### Tracks (layer width: path | path; a pad name or v marks a point on that pad's centre or on a via)
3.3V  (via drill 0.3)
  Top 0.2: 22,89.5 22,89 22.31,88.69 U6.5 U6.6 | 22,89.5 C14.P$1 | U6.6 21.25,88.5 20.5,88.5 20,89 C15.P$1 20.18,89.68 v21,90.5 22,89.5 | C24.P$1 70.18,57.96 U10.57 65.24,57.96 v64.5,58.7 61.4,55.6 61.4,54.55 | U6.6 U6.7 20.41,87.24 19.95,87.7 16.85,87.7 16.15,87 v16.15,85.4 | R24.P$1 R26.P$1 21.5,95.18 v21.5,95 | R3.P$2 C2.P$1 63.47,81.82 v62.95,81.31 U3.8 62.95,78 60.95,76 60.95,73.06 C22.P$1 61.83,70.83 61.42,70.42 U10.82 61.42,66.87 v61.4,66.85 | J4.4 47.55,83.09 48.14,82.5 50.5,82.5 C8.P$1 52.6,82.5 54.37,82.5 R11.P$2 56.5,82.43 v56.5,83.1 | 61.42,51.5 61.42,50.96 C17.P$1 62.58,48.62 v62.6,48.6 | 61.42,51.5 U10.44 61.42,54.48 61.35,54.55 | C18.P$1 50.68,59 U10.17 51.45,58.96 51.7,58.72 51.7,58.15 v52.2,57.65 | 61.42,51.5 61.92,52 U10.45 61.92,54.13 61.5,54.55 61.4,54.55 | U7.8 33.58,78.68 | C12.P$1 34.47,78.68 33.58,78.68 | 33.58,78.68 33.08,78.18 U7.9 v31.05,78.18 29.47,78.18 v28.45,79.2 | U7.7 33.08,79.18 33.58,78.68 | U7.41 35,62.18 C13.P$1 35.2,61.98 R14.P$2 R15.P$2 | R35.P$2 v37.85,63.7 | v31,62.2 32.24,62.2 U7.41 | U7.42 U7.41 | U7.40 U7.41 | U7.35 31.47,65.18 v31,65.65 | v64.35,66.85 65.24,65.96 U10.73 69.97,65.96 70.68,66.67 C25.P$1 70.68,67.78 v70.7,67.8 | v52.2,63.5 52.16,63.46 U10.8 49.52,63.46 48.68,64.3 C20.P$1 47.77,64.27 46.8,63.3 41.7,63.3 v41.3,63.7 | v54.9,55.9 54.9,53.28 U10.31 54.92,49.9 C16.P$1 56.13,50.95 57.75,50.95 58.82,49.88 C19.P$1 59.92,50.9 U10.41 59.92,54.17 60.3,54.55 61.35,54.55 | 61.35,54.55 61.4,54.55 | v64,40.8 R13.P$2 v63,28.32 R12.P$2 59.8,26.13 C9.P$1 | C9.P$1 53.61,26 U4.8 | U4.16 45.1,27.3 44,26.2 v44,22.7 | v53.7,22.7 53.7,26.09 C9.P$1
  Top 0.2: U2.8 71.39,25.94 C5.P$1 73.74,25.8 | 73.74,25.8 73.74,24.84 v72.5,23.6 | R5.P$2 81.1,24 79.2,25.9 73.84,25.9 73.74,25.8 | R28.P$2 v30.8,13.5 | M1.9 83.58,83.08 C10.P$1 86.3,74.6 84,72.3 82.47,72.3 TC1.1
  Bottom 0.2: v21.5,95 21.05,94.55 21.05,90.55 v21,90.5 | v28.45,79.2 20.25,79.2 16.15,83.3 v16.15,85.4 | v62.95,81.31 62,80.35 59.25,80.35 v56.5,83.1 | v31.05,78.18 31,78.13 v31,65.65 30.5,65.65 29.9,65.05 29.9,62.65 30.35,62.2 v31,62.2 36.35,62.2 v37.85,63.7 v41.3,63.7 | v52.2,63.5 57.65,63.5 61,66.85 v61.4,66.85 v64.35,66.85 65.6,65.6 65.6,59.8 v64.5,58.7 | v52.2,57.65 53.95,55.9 v54.9,55.9 | v64,40.8 64,47.2 v62.6,48.6 | v53.7,22.7 v44,22.7 41.7,22.7 40,21 34.5,21 30.8,17.3 v30.8,13.5 | v72.5,23.6 67.78,28.32 v63,28.32 | TC1.1 81.6,71.5 81.3,71.5 80.6,72.2 76.8,72.2 72.4,67.8 v70.7,67.8
  other vias: 81.64,71.46
5V  (via drill 0.3)
  Top 0.2: R6.P$2 2.68,39.18 v3,39.5 | C6.+ 21,21 | C26.P$1 70.02,65.46 U10.72 64.54,65.46 62.92,67.08 U10.79 | U9.5 44.15,35.15 44.5,35.5 44.51,35.49 v45.29,35.49 46.29,35.49 46.3,35.5 46.65,35.15 U8.5 46.83,34.68 C23.P$1
  Top 0.203: 87.42,18.58 87.3,18.58
  Top 0.305: U7.1 31.51,82.18 31.06,81.73 31.06,79.66 v30.2,78.8
  Top 0.508: R21.P$2 v27.6,53 R23.P$2 | L1.2 21,21 v19,21 | 25.95,20.9 C4.1 | v70.7,63.5 70.7,64.78 C26.P$1 | J6.P$2 87.42,18.58 | 87.3,18.58 U5.5 82.75,21.35 v77.4,21.35
  Top 1: L1.2 C6.+ 25.95,20.9 | C4.1 30.35,20.85 33.5,24 33.5,39 v35.5,41
  Bottom 0.2: v3,39.5 3,33 15,21 v19,21 | 50.9,25 arc-45 45.95,27.15
  Bottom 0.508: v35.5,41 38.25,43.75 50.4,43.75 63.3,56.65 73.75,56.65 75.8,58.7 75.8,62.2 74.5,63.5 v70.7,63.5 | v35.5,41 35.5,49 31.5,53 v27.6,53 29.2,54.6 29.2,65.5 30.2,66.5 v30.2,78.8 | v35.5,41 41,35.5 v45.28,35.5 v45.29,35.49 | D9.5 50.95,37.8 | 46.88,27.93 D14.5 | v77.4,21.35 66.68,32.07 D11.5
  pour Bottom: 58,32 arc-90 51.01,25.01 50.35,25.05 49.7,25.15 48.05,25.65 46.78,26.42 46.72,26.46 45.95,27.15 47.38,28.57 50,27 52,27 54,28 55,29 55.5,30 56,31.5 56,32.5 55,34.5 53.5,36.5 50.5,37 49,36.5 47,35 46,33.5 46,32 44,32 arc-90 51,39 arc-90
12V  (via drill 0.3)
  Top 0.2: J7.2 88.32,6.55 R22.P$2 | 7,17.4 GND.P$1 | U1.5 13.05,30.14 | R1.P$2 R8.P$2 v5.16,29.16 | v7,24 D3.C 7.1,22.4
  Top 1: v7,8.5 7,17.4 | GND.P$1 7.1,22.4 | D3.C 9.4,22.5 11,20.9 C11.+ 13,28.45 C1.1 13.05,30.14
  Bottom 0.2: v5.16,29.16 5.84,29.16 7,28 v7,24
  Bottom 1: J7.2 85.23,4.73 81.5,1 11.5,1 7,5.5 v7,8.5
!RESET  (via drill 0.3)
  Top 0.2: TC1.10 80.36,70.97 80.1,70.7 80.1,66.8 SW1.2 SW1.1 81.9,59 v74,59 | v60.5,55.3 60.5,57.9 59.3,59.1 58.5,59.1 57.42,58.02 U10.36
  Bottom 0.2: v74,59 72.5,57.5 62.7,57.5 v60.5,55.3
!TFT_RESET  (via drill 0.3)
  Top 0.2: U10.14 46.44,60.46 v44.6,62.3 | v34,77 33.32,77.68 U7.10
  Bottom 0.2: v44.6,62.3 34,72.9 v34,77
!TTFT-IRQ  (via drill 0.3)
  Top 0.2: U7.46 33.02,59.68 33.6,59.1 v33.6,58.5 | v53,58.5 53,60.2 51.74,61.46 U10.12
  Bottom 0.2: v53,58.5 52.9,58.4 33.7,58.4 v33.6,58.5
!TTFT-RST  (via drill 0.3)
  Top 0.2: U7.47 30.58,59.18 v30.4,59 | v52.3,59.3 51.64,59.96 U10.15
  Bottom 0.2: v30.4,59 30.6,59.2 52.2,59.2 v52.3,59.3
BLE-!RST  (via drill 0.3)
  Top 0.2: U10.60 68.7,59.47 v69,59.77 | v81.9,86 M1.11
  Bottom 0.2: v69,59.77 69.1,59.87 69.1,73.2 v81.9,86
BLE-KEY  (via drill 0.3)
  Top 0.2: M1.16 82,93.5 80.9,92.4 v80.9,86 | v68.39,60.5 67.85,59.96 U10.61
  Bottom 0.2: v80.9,86 68.39,73.49 v68.39,60.5
DECOUPLE
  Top 0.2: U10.59 69.18,58.96 70.47,60.25 C27.P$1
DOOR-SW
  Top 0.2: R4.P$2 84,26.82 84,27.18 C3.P$1 84.82,51.18 78.54,57.46 U10.56
GND  (via drill 0.3, 0.35)
  Top 0.2: U6.2 23.81,86.74 U6.PAD | U7.11 U7.12 U7.13 U7.14 U7.15 U7.16 U7.17 U7.18 U7.19 U7.20 U7.21 U7.22 U7.23 U7.24 U7.25 U7.26 U7.27 U7.28 U7.29 U7.30 U7.31 U7.32 30.78,66.68 30,65.9 30,63.7 30.52,63.18 U7.39
  other vias: 63,39.5 63,38 63,36.5 63,35 63,33.5 45.5,78 46.5,77 47.5,76 48.5,75 31,63.4 48,25 1.5,45 1.5,43.5 1.5,42 6,44 7.5,44 9,44 10.5,44 12,44 5.5,53.5 5.5,52 5.5,50.5 5.5,49 5.5,47.5 5.5,61 5.5,59.5 5.5,58 5.5,56.5 5.5,55 5.5,68.5 5.5,67 5.5,65.5 5.5,64 5.5,62.5 5.5,76 5.5,74.5 5.5,73 5.5,71.5 5.5,70 5.5,83.5 5.5,82 5.5,80.5 5.5,79 5.5,77.5 5.5,91 5.5,89.5 5.5,88 5.5,86.5 5.5,85 5.5,94 5.5,92.5 1.5,98.5 3,98.5 4.5,98.5 6,98.5 7.5,98.5 9,98.5 10.5,98.5 12,98.5 13.5,98.5 15,98.5 16.5,98.5 18.5,97 18.5,95.5 18.5,94 18.5,92.5 18.5,91 14.5,83 14.5,84.5 14.5,86 14.5,87.5 14.5,89 18,79 17,80 16,81 20,77.5 21.5,77.5 23,77.5 24.5,77.5 26,77.5 28,86.7 29.5,86.7 31,86.7 32.5,86.7 34,86.7 32.5,84 34,84 35,98.5 36.5,98.5 38,98.5 39.5,98.5 41,98.5 42.5,98.5 44,98.5 45.5,98.5 47,98.5 48.5,98.5 50,98.5 51.5,98.5 53,98.5 54.5,98.5 56,98.5 57.5,98.5 59,98.5 60.5,98.5 62,98.5 63.5,98.5 65,98.5 66.5,98.5 68,98.5 66.5,93 66.5,91.5 66.5,90 57.5,87.5 58.5,88.5 46,86.5 47.5,86.5 49,86.5 50.5,86.5 52,86.5 72.5,93 72.5,91.5 72.5,90 72.5,88.5 72.5,87 74.5,93 76,93 77.5,93 79.5,93 79.5,91.5 79.5,90 79.5,88.5 79.5,87 72.5,85.5 72.5,84 76.5,83.5 77.5,84.5 74,81 75,82 71.5,78.5 72.5,79.5 75,77.5 76,78.5 77.5,80 78.5,81 80,82.5 81,83.5 86,90 86,88.5 86,87 88.5,87 88.5,88.5 88.5,90 88.5,91.5 88.5,93 88.5,85.5 88.5,84 88.5,82.5 88.5,81 88.5,79.5 85,81 85,79.5 85,78 88.5,78 88.5,76.5 88.5,75 88.5,73.5 88.5,72 88.5,70.5 88.5,69 88.5,67.5 88.5,66 88.5,64.5 74.5,68 75.5,69 80.5,64.5 79.5,65.5 83.5,64 83.5,62.5 83.5,61 83.5,59.5 88.5,63 88.5,61.5 88.5,60 88.5,58.5 88.5,57 88.5,55.5 88.5,54 88.5,52.5 88.5,51 88.5,49.5 86,54 86,52.5 86,51 86,49.5 86,48 79,54 79,52.5 79,51 79,49.5 79,48 83.5,54 83.5,49.5 83.5,48 83.5,51 83.5,45 83.5,43.5 83.5,42 83.5,40.5 83.5,39 79,45 79,43.5 79,42 79,40.5 76.5,42 75.5,43 74.5,44 75,40.5 74,41.5 73,42.5 86,45 86,43.5 86,39 88.5,48 88.5,46.5 88.5,45 88.5,43.5 88.5,42 88.5,40.5 88.5,39 88.5,37.5 88.5,36 88.5,34.5 86,36 86,34.5 86,33 86,31.5 86,30 83.5,36 83.5,34.5 83.5,33 83.5,31.5 83.5,30 88.5,33 88.5,31.5 88.5,30 79,36 79,34.5 79,33 79,31.5 79,30 79.5,23.5 78.5,24.5 70.5,18 69.5,19 67.5,18 68.5,19 55.5,22 57,22 58.5,22 60,22 61.5,22 55.5,25 57,25 58.5,25 60,25 61.5,25 58,27.5 59.5,27.5 59.5,30.5 61,30.5 59.5,33.5 61,33.5 63,31 63,29.5 66.5,31 66.5,29.5 66.5,39.5 66.5,38 66.5,36.5 66.5,35 66.5,33.5 67.5,42 68.5,43 69.5,44 52,40 53.5,40 55,40 56.5,40 58,40 52,43 53.5,43 55,43 56.5,43 58,43 49.5,33.5 51,33.5 52.5,33.5 49.5,31 51,31 52.5,31 50.5,18 49.5,19 47.5,18 48.5,19 40,14.5 40,13 40,11.5 40,10 40,8.5 42.5,21.5 41.5,20.5 41.5,24 40.5,23 40,32 40,30.5 40,29 40,27.5 40,26 42,2.5 43.5,2.5 45,2.5 46.5,2.5 48,2.5 49.5,2.5 51,2.5 52.5,2.5 54,2.5 55.5,2.5 57,2.5 58.5,2.5 60,2.5 61.5,2.5 63,2.5 64.5,2.5 66,2.5 67.5,2.5 69,2.5 70.5,2.5 72,2.5 73.5,2.5 75,2.5 76.5,2.5 78,2.5 70,53.5 70,52 70,50.5 70,49 66.5,53.5 66.5,52 66.5,49 66.5,47.5 56,62 57.5,62 59,62 60.5,62 55.4,57.2 55.4,58.7 48.6,61.9 42,62 38.4,61.9 40.5,57 41.5,56 43.5,55 45,55 46.5,55 44,66.5 45.5,66.5 47,66.5 42.5,69 44,69 45.5,69 47,69 41.5,75 41.5,73.5 41.5,72 41.5,70.5 39,75 39,73.5 39,72 39,70.5 36.5,69 37.5,68 29,73 29,71.5 29,70 29,68.5 29,67 27.5,65 27.5,63.5 27.5,62 27.5,60.5 27.5,59 34,71.5 34,70 34,68.5 34,67 21,52 22,53 23,54 20,49.5 20,48 24,49.5 24,48 24,46.5 24,45 25.5,51 27,51 28.5,51 30,51 31.5,49.5 31.5,48 31.5,46.5 31.5,45 25.4,44 26.9,44 28.4,44 29.9,44 36,51 35,52 34,53 33,54 34.5,48 34.5,46.5 34.5,45 37,48 37,46.5 37,45 41,45.5 42.5,45.5 44,45.5 7.5,41 9,41 10.5,41 12,41 13.5,41 25.4,41.5 26.9,41.5 28.4,41.5 29.9,41.5 31.5,37.5 31.5,36 31.5,34.5 31.5,33 31.5,31.5 31.5,30 31.5,28.5 31.5,27 31.5,25.5 30.5,24 29.5,23 26,22.5 27.5,22.5 16.5,22.5 18,22.5 15,31.5 15,30 15,28.5 15,27 15,25.5 10,34.5 10,33 10,31.5 10,30 10,28.5 13.5,36.5 15,36.5 16.5,36.5 8,26 9,25 10,24 11,23 5,20 5,18.5 5,17 5,15.5 5,14 10.5,18.5 10.5,17 10.5,15.5 15,18.5 15,17 15,15.5 19,18.5 19,17 19,15.5 23,18.5 23,17 23,15.5 29.5,17.5 28.5,16.5 31.5,19.5 30.5,18.5 33.5,21.5 32.5,20.5 34,19 33,18 32,17 36,13 36,11.5 36,10 36,8.5 1.5,2.5 1.5,4 1.5,5.5 1.5,7 1.5,8.5 1.5,10 3,1 4.5,1 6,1 7.5,1 9,1 12,2.5 13.5,2.5 15,2.5 16.5,2.5 18,2.5 19.5,2.5 21,2.5 22.5,2.5 24,2.5 25.5,2.5 27,2.5 28.5,2.5 30,2.5 31.5,2.5 33,2.5 34.5,2.5 36,2.5 37.5,2.5 39,2.5 40.5,2.5 39.5,35.5 38.5,36.5 37.5,37.5 41,40 42.5,40 44,40 49.5,74 50.5,73 54.5,66.5 56,66.5 57.5,66.5 59,66.5 63.5,76.5 63.5,75 63.5,73.5 70.5,72.5 70.5,71 70.5,69.5 65.5,70.5 65.5,69 70,55 71.5,55 73,55 55.5,79 55.5,77.5 27.5,84 27.5,82.5 68.5,26.5 68.5,25.5 69.5,25.5 47.5,47.5 48.5,48.5 49.5,49.5 50.5,50.5 21,31.5 23,31.5 22,30.5 23,29.5 24,30.5 21,29.5 20,30.5 19,31.5 18,30.5 19,29.5 26.5,30.5 26.5,32.5 27.5,31.5 28.5,32.5 27.5,33.5 28.5,30.5 27.5,29.5 26.5,28.5 27.5,27.5 28.5,28.5 23,8.5 25,8.5 26,7.5 27,8.5 29,8.5 28,7.5 27,6.5 28,5.5 29,6.5 29,4.5 27,4.5 26,5.5 25,6.5 24,7.5 23,6.5 24,5.5 25,4.5 23,4.5 45.5,12.5 47.5,12.5 48.5,11.5 49.5,12.5 51.5,12.5 50.5,11.5 49.5,10.5 50.5,9.5 51.5,10.5 51.5,8.5 49.5,8.5 48.5,9.5 47.5,10.5 46.5,11.5 45.5,10.5 46.5,9.5 47.5,8.5 45.5,8.5 65.5,12 67.5,12 68.5,11 69.5,12 71.5,12 70.5,11 69.5,10 70.5,9 71.5,10 71.5,8 69.5,8 68.5,9 67.5,10 66.5,11 65.5,10 66.5,9 67.5,8 65.5,8 11,53.5 11,55.5 12,56.5 11,57.5 11,59.5 12,58.5 13,57.5 14,58.5 13,59.5 15,59.5 15,57.5 14,56.5 13,55.5 12,54.5 13,53.5 14,54.5 15,55.5 15,53.5 11,64.5 11,66.5 12,67.5 11,68.5 11,70.5 12,69.5 13,68.5 14,69.5 13,70.5 15,70.5 15,68.5 14,67.5 13,66.5 12,65.5 13,64.5 14,65.5 15,66.5 15,64.5 20.5,64.5 20.5,66.5 21.5,67.5 20.5,68.5 20.5,70.5 21.5,69.5 22.5,68.5 23.5,69.5 22.5,70.5 24.5,70.5 24.5,68.5 23.5,67.5 22.5,66.5 21.5,65.5 22.5,64.5 23.5,65.5 24.5,66.5 24.5,64.5 43.5,93.5 45.5,93.5 46.5,92.5 47.5,93.5 49.5,93.5 48.5,92.5 47.5,91.5 48.5,90.5 49.5,91.5 49.5,89.5 47.5,89.5 46.5,90.5 45.5,91.5 44.5,92.5 43.5,91.5 44.5,90.5 45.5,89.5 43.5,89.5 57.5,95 59.5,95 60.5,94 61.5,95 63.5,95 62.5,94 61.5,93 62.5,92 63.5,93 63.5,91 61.5,91 60.5,92 59.5,93 58.5,94 57.5,93 58.5,92 59.5,91 57.5,91
  pour Bottom (rank 2): -0.5,100.5 90.5,100.5 90.5,-0.5 -0.5,-0.5 -0.5,47 3.5,47 3.5,95 -0.5,95
  pour Top (rank 2): -0.5,100.5 90.5,100.5 90.5,-0.5 -0.5,-0.5 -0.5,47 3.5,47 3.5,95 -0.5,95
GND151  (via drill 0.3)
  other vias: 33.8,61.5
GND152  (via drill 0.3)
  other vias: 34,62.9
GND153  (via drill 0.3)
  other vias: 57,51.8
I2C0-SCL-SENS  (via drill 0.3)
  Top 0.2: U4.19 45.45,25.35 v45.3,25.5 | U2.19 65.15,25.35 v65,25.5 64,26.5 R13.P$1 64.58,26.68 65.5,27.6 65.5,41.8 68.6,44.9 68.6,55.2 67.84,55.96 U10.53
  Bottom 0.2: v45.3,25.5 46.85,23.95 63.45,23.95 v65,25.5
I2C0-SDA-SENS  (via drill 0.3)
  Top 0.2: U2.20 65.2,24.7 v65,24.5 64.18,24.5 62.09,26.59 | U4.20 45.5,24.7 v45.3,24.5 | R12.P$1 62.09,26.59 | U10.52 67.44,55.46 68,54.9 68,45.2 64.9,42.1 64.9,27.8 64.6,27.5 63,27.5 62.09,26.59
  Bottom 0.2: v45.3,24.5 46.4,23.4 63.9,23.4 v65,24.5
I2C1-SCL-TTFT  (via drill 0.3)
  Top 0.2: U10.40 59.42,57.9 v58.91,58.41 | v30.4,60.86 30.58,60.68 U7.44 33.32,60.68 34.5,59.5 35.81,59.5 36.63,58.68 R15.P$1
  Bottom 0.2: v58.91,58.41 56.46,60.86 v30.4,60.86
I2C1-SDA-TTFT  (via drill 0.3)
  Top 0.2: U10.39 58.92,57.08 v58.25,57.75 | v30.4,60 30.58,60.18 U7.45 33.2,60.18 34.7,58.68 R14.P$1
  Bottom 0.2: v58.25,57.75 56,60 v30.4,60
MAIN_HFXTAL_N
  Top 0.2: Y1.1 60.42,47.92 U10.42
MAIN_HFXTAL_P
  Top 0.2: Y1.2 60.92,47.98 U10.43
MAIN_LFXTAL_N
  Top 0.2: Y2.4 47.5,51.56 47.5,52.7 49.8,55 50.68,55 U10.25
MAIN_LFXTAL_P
  Top 0.2: Y2.1 47.18,53.18 49.46,55.46 U10.24
N$1
  Top 0.2: J2.1 87.27,24.73 86,26 R4.P$1 R5.P$1
N$2
  Top 0.203: U5.4 86.72,17.28 87.3,16.7 88.6,16.7 89.3,17.4 89.3,19.24 J6.P$1
N$3
  Top 0.2: R34.P$2 23.32,95 26.5,95 27.29,94.21 J10.B5
N$4
  Top 0.2: R23.P$1 30.3,53
  Top 0.508: B1.1 33.27,50.03 30.3,53
N$5
  Top 0.2: J10.A5 30.31,91.65 R33.P$2
N$6
  Bottom 0.2: D7.1 46.8,32.9 arc-45 47.5,34.4 47.49,34.4 D8.3
N$7  (via drill 0.3)
  Top 0.2: U9.4 42.85,34 44.35,32.5 44.35,31.1 v45,30.45
  Bottom 0.2: v45,30.45 45,31.17 D7.4
N$8  (via drill 0.3)
  Top 0.2: U8.4 45.35,31.15 v46.05,30.45
  Bottom 0.2: v46.05,30.45 46.8,31.2 D7.3
N$9
  Bottom 0.2: D8.4 46.29,35.6 46.3,35.6 arc45 45.1,32.9 D7.6
N$10
  Bottom 0.2: D9.3 50.17,36.2 50.2,36.2 arc45 48.6,35.6 48.6,35.59 D8.1
N$11
  Bottom 0.2: D9.4 50.18,37.92 50.2,37.9 arc45 47.4,36.7 47.4,36.75 D8.6
N$12
  Bottom 0.2: D10.3 53.32,35.58 53.3,35.6 arc45 51.8,36.2 51.78,36.22 D9.1
N$13  (via drill 0.3)
  Top 0.2: v21.8,82.5 v21.81,82.51 U6.13
  Bottom 0.2: D5.C 26.25,96.92 25.18,95.85 23.6,95.85 21.8,94.05 v21.8,82.5
N$14
  Bottom 0.2: D10.4 54.52,36.72 54.5,36.7 arc45 51.8,37.9 51.78,37.92 D9.6
N$15  (via drill 0.3)
  Top 0.2: v22.8,82.5 22.31,82.99 U6.14
  Bottom 0.2: D6.C 30.85,97 29.1,95.25 24,95.25 22.8,94.05 v22.8,82.5
N$16  (via drill 0.3)
  Top 0.2: R26.P$2 22.9,96 23.3,95.6 27.8,95.6 v29.3,97.1
  Bottom 0.2: D6.A 29.3,98.05 v29.3,97.1
N$17
  Top 0.2: 21.96,45.5 B1.2
  Top 0.508: B1.2 22.07,50.09 R21.P$1 | Q1.P$3 21.96,45.5
N$18
  Top 0.2: R17.P$2 14.63,46.45 Q1.P$1
N$19  (via drill 0.3)
  Top 0.2: R24.P$2 23,97.32 23,96.9 23.7,96.2 26.9,96.2 27.7,97 v27.7,97.1
  Bottom 0.2: D5.A 27.7,98.05 v27.7,97.1
N$20
  Bottom 0.2: D10.1 54.5,34.4 arc-45 55.1,32.9 D11.3
N$21
  Bottom 0.2: D11.4 56.8,32.9 arc45 55.6,35.6 D10.6
N$22
  Bottom 0.2: D11.1 55.1,31.3 arc-45 54.5,29.7 D12.3
N$23
  Bottom 0.2: D11.6 56.8,31.2 arc-45 55.7,28.5 D12.4
N$24
  Bottom 0.2: D12.1 53.32,28.52 53.3,28.5 arc-45 51.8,28 51.75,27.95 D13.3
N$25
  Top 0.2: R27.P$2 42.81,80.51 Q4.P$1
N$26
  Bottom 0.2: D12.6 54.52,27.32 54.5,27.3 arc-45 51.8,26.2 51.78,26.22 D13.4
N$27
  Bottom 0.2: D13.1 50.18,27.92 50.2,27.9 arc-45 48.6,28.5 48.6,28.55 D14.3
N$28
  Bottom 0.2: D14.4 47.38,27.32 47.4,27.3 arc45 50.2,26.2 50.17,26.2 D13.6
N$30
  Top 1: J5.P$1 2.9,12.56 GND.P$2
N$31
  Top 0.508: 14.5,34.41 U1.8
  Top 1: D1.C 18,38.5 L1.1 19.91,34.41 14.5,34.41
N$32
  Top 0.2: R7.P$2 2.68,36.2 4.32,37.85 R6.P$1 4.32,37.98 7.4,34.91 U1.1
N$34
  Top 0.2: R1.P$1 2.68,32.35 R2.P$2 6.46,31.86 U1.3
N$35  (via drill 0.3)
  Top 0.2: R10.P$2 88.5,95.82 v88.5,98.5
  Bottom 0.2: v88.5,98.5 87.06,98.5 D2.A
N$36
  Top 0.2: M1.15 83.68,92.18 R10.P$1
N$56
  Top 0.2: Q3.P$1 79.62,4.44 R19.P$2
N$57
  Top 0.2: J7.1 Q3.P$3
N$58
  Top 0.2: Q2.P$1 79.6,9.99 R18.P$2
N$59
  Top 0.2: Q2.P$3 84.41,9.81 J7.4 86.68,9.99 R22.P$1
N$64  (via drill 0.3)
  Top 0.2: v84,11.5 84,11.88 R20.P$2
  Bottom 0.2: J7.3 84,9.77 v84,11.5
PRS-CH11-SSR-OUT  (via drill 0.3)
  Top 0.2: U10.51 67.02,54.96 67.42,54.56 67.42,45.52 v62.7,40.8 | v38.8,41.8 35.4,38.4 35.4,22 26.7,13.3 20.76,13.3 J9.P$1
  Bottom 0.2: v38.8,41.8 39.81,40.79 v62.69,40.79 v62.7,40.8
QSPI_CLK
  Top 0.2: U3.6 U10.84
QSPI_CS0
  Top 0.2: U10.85 59.92,71.48 59.8,71.6 59.8,81.43 62.95,84.59 U3.1 64.58,86.24 R3.P$1
QSPI_D0
  Top 0.2: U3.5 59.15,71.64 58.42,70.92 U10.88
QSPI_D1
  Top 0.2: U10.89 57.92,80.52 61.69,84.28 U3.2
QSPI_D2
  Top 0.2: U10.90 57.42,80.92 60.41,83.92 U3.3
QSPI_D3  (via drill 0.3)
  Top 0.2: U10.91 56.92,81.32 59.5,83.9 v59.5,84 | v61.7,81.3 61.7,79.59 U3.7
  Bottom 0.2: v59.5,84 61.7,81.8 v61.7,81.3
SDIO-CD  (via drill 0.3)
  Top 0.2: U10.86 59.42,70.39 v59.31,70.5 | J4.9 53,84.7 v53,83.5 53.46,83.04 R11.P$1
  Bottom 0.2: v59.31,70.5 59.31,77.19 v53,83.5
SDIO-CLK  (via drill 0.3)
  Top 0.2: U10.97 53.92,72.08 v48.5,77.5 | v48.6,83.5 48.65,83.55 J4.5
  Bottom 0.2: v48.6,83.5 48.6,77.6 v48.5,77.5
SDIO-CMD  (via drill 0.3)
  Top 0.2: U10.96 54.42,72.58 v46.5,80.5 | v46.5,83.61 46.5,84.7 J4.3
  Bottom 0.2: v46.5,80.5 v46.5,83.61
SDIO-DAT0  (via drill 0.3)
  Top 0.2: U10.95 54.92,72.98 v50.9,77 | v50.9,83.5 50.9,84.7 J4.7
  Bottom 0.2: v50.9,77 51.25,77.35 51.25,83.15 v50.9,83.5
SDIO-DAT1  (via drill 0.3)
  Top 0.2: U10.94 55.42,73.58 v52,77 | v52,83.5 52,84.7 J4.8
  Bottom 0.2: v52,83.5 51.7,83.2 51.7,77.3 v52,77
SDIO-DAT2
  Top 0.2: U10.93 55.92,74.08 48.7,81.3 46.2,81.3 44.25,83.25 J4.1
SDIO-DAT3
  Top 0.2: U10.92 56.42,74.58 49.1,81.9 47.1,81.9 45.35,83.65 J4.2
SWCLK  (via drill 0.3)
  Top 0.2: v74,73.6 73.9,73.7 67.4,73.7 64.42,70.72 U10.76
  Bottom 0.2: TC1.4 79.97,73.6 v74,73.6
  other vias: 81.64,75.27
SWDIO  (via drill 0.3)
  Top 0.2: v75.6,72.99 v75.6,73 74.3,74.3 67.2,74.3 63.92,71.02 U10.77
  Bottom 0.2: TC1.2 81.37,72.99 v75.6,72.99
  other vias: 81.64,72.73
SWO  (via drill 0.3)
  Top 0.2: U10.78 63.42,71.32 67,74.9 73.9,74.9 v74,75
  Bottom 0.2: TC1.6 80.36,75.06 79.52,74.22 74.78,74.22 v74,75
  other vias: 80.36,76.54
TC_VIN0+  (via drill 0.3)
  Top 0.2: v68.3,22 68.35,22.05 U2.2
  Bottom 0.2: J1.1-T+ 72.05,18.25 v68.3,22
TC_VIN0-
  Top 0.2: J1.2-T- 65.95,18.25 69.6,21.9 69.6,23.62 U2.4
TC_VIN1+  (via drill 0.3)
  Top 0.2: v48.3,22 48.35,22.05 U4.2
  Bottom 0.2: J3.1-T+ 52.05,18.25 v48.3,22
TC_VIN1-
  Top 0.2: J3.2-T- 45.85,18.25 49.65,22.05 U4.4
TFT-DC  (via drill 0.3)
  Top 0.2: U10.19 44.54,57.96 43.6,58.9 v43.6,61.5 | U7.37 31.32,64.18 v31,64.5
  Bottom 0.2: v31,64.5 31.3,64.8 41.1,64.8 43.6,62.3 v43.6,61.5
TFT-LEDK
  Top 0.2: R32.P$1 37.18,81.46 Q4.P$3 37.16,81.46 R29.P$1
TFT-LEDK1
  Top 0.2: U7.2 34.06,81.68 R29.P$2
TFT-LEDK2
  Top 0.2: U7.3 34.1,81.18 R32.P$2
TIM0-CC2-BUZZ
  Top 0.2: R17.P$1 14.5,44 15.4,43.1 45.2,43.1 52.92,50.82
TIM1-CC0-TFT-BL  (via drill 0.3)
  Top 0.2: U10.9 47.56,62.96 46.9,62.3 v46.1,62.3 | R27.P$1 40.35,78.68 R25.P$2 40.32,76.32 v40.3,76.3
  Bottom 0.2: v46.1,62.3 45.6,62.3 40.3,67.6 v40.3,76.3
TIM2-CC2FAN0-SNSE  (via drill 0.3)
  Top 0.2: R20.P$1 R16.P$2 81.32,13.82 v81.5,14 | U10.70 68.04,64.46 70,62.5 v80,62.5
  Bottom 0.2: v80,62.5 80,62 81.5,60.5 v81.5,14
TIM5-CC0-FAN0-GND  (via drill 0.3)
  Top 0.2: R19.P$1 v82.8,5 | U10.68 67.64,63.46 69.6,61.5 78.5,61.5 79,61 v80,61
  Bottom 0.2: v82.8,5 80.69,7.11 80.69,14.25 81,14.56 81,60 v80,61
TIM5-CC1-FAN0-CTRL  (via drill 0.3)
  Top 0.2: R18.P$1 82.75,10.55 v82.8,10.6 | U10.69 67.84,63.96 69.8,62 78.89,62 v79,61.89
  Bottom 0.2: v79,61.89 79,62.5 79.7,63.2 80.3,63.2 82,61.5 82,14.6 82.4,14.2 82.4,11 v82.8,10.6
U0RX-USB-TX  (via drill 0.3)
  Top 0.2: U6.21 36.06,85.74 v37.5,84.3 | v52.7,64.9 52.64,64.96 U10.5
  Bottom 0.2: v37.5,84.3 52.7,69.1 v52.7,64.9
U0TX-USB-RX  (via drill 0.3)
  Top 0.2: U6.20 35.56,85.24 v37.5,83.3 | v52.01,65.9 51.57,65.46 U10.4
  Bottom 0.2: v37.5,83.3 52.01,68.79 v52.01,65.9
U1RX-BLE-TX  (via drill 0.3)
  Top 0.2: U10.63 66.85,60.96 v67.49,61.6 v67.5,61.6 | v68.4,92 M1.2
  Bottom 0.2: v67.5,61.6 67.5,87 69.2,88.7 69.2,91.2 v68.4,92
U1TX-BLE-RX  (via drill 0.3)
  Top 0.2: U10.62 67.39,60.46 v67.5,60.57 | v68.4,89 M1.4
  Bottom 0.2: v67.5,60.57 66.8,61.27 66.8,87.4 v68.4,89
UART_VBUS
  Top 0.2: R31.P$2 19.28,86.74 | 19.28,86.74 U6.8 | R30.P$1 17.58,86.74 19.28,86.74
US0-LED-MOSI  (via drill 0.3)
  Top 0.2: U10.67 63.96,62.96 63,62 v63,61 | v53.03,48.47 48,43.44 48,41.6 46,39.6 U8.2
  Bottom 0.2: v63,61 52.53,50.53 52.53,48.97 v53.03,48.47
US0-LED-SCK  (via drill 0.3)
  Top 0.2: U9.2 43.5,37.9 47.5,41.9 47.5,43.8 53.19,49.49 53.7,49.49 v53.7,49.6 | v64.5,60.5 64.1,60.5 63.7,60.9 63.7,61.86 64.05,62.21 64.95,62.21 65.2,61.96 U10.65
  Bottom 0.2: v64.5,60.5 64.5,60.4 v53.7,49.6
US2-CLK-TFT
  Top 0.2: U7.36 37.82,64.68 40.35,62.15 40.35,59.65 43.54,56.46 U10.22
US2-CS-TFT
  Top 0.2: U7.38 35.16,63.68 | 35.16,63.68 R35.P$1 | U10.23 43.17,55.96 39.8,59.33 39.8,61.9 38.8,62.9 35.94,62.9 35.16,63.68
US2-MISO-TFT  (via drill 0.3)
  Top 0.2: U10.21 52.66,56.96 53.7,58 53.7,65.9 51.7,67.9 41.7,67.9 v39.6,65.8 | v35.52,66.68 35.02,66.18 U7.33
  Bottom 0.2: v35.52,66.68 35.52,66.58 36.3,65.8 v39.6,65.8
US2-MOSI-TFT
  Top 0.2: U7.34 37.72,65.68 40.9,62.5 40.9,60 43.44,57.46 U10.20
USB-RST  (via drill 0.3)
  Top 0.2: U10.3 49.34,65.96 v49.3,66 | U6.9 20.58,86.24 20.2,85.86 v20.2,81
  Bottom 0.2: v49.3,66 49.3,69.72 38.02,81 v20.2,81
USB-SUS  (via drill 0.3)
  Top 0.2: U6.17 23.81,82.49 v26,80.3 | v48.59,66.6 v48.6,66.61 49.65,66.61 49.8,66.46 U10.2
  Bottom 0.2: v26,80.3 37.85,80.3 48.69,69.46 48.69,66.7 v48.59,66.6
USB-UART-D+
  Top 0.2: D4.3 28.31,90.83 J10.B6 | D4.3 28.38,89.4 30,89.4 30.23,89.63 30.23,90.65 29.31,91.58 J10.A6 | U6.3 23.31,88.81 24.65,90.15 D4.3
USB-UART-D-
  Top 0.2: D4.2 28.81,90.77 J10.B7 28.81,93.79 28.6,94 28,94 27.81,93.81 J10.A7 27.81,91.71 26.7,90.6 24.5,90.6 22.81,88.91 U6.4
V_USB  (via drill 0.3)
  Top 0.2: J10.B4_A9 26.16,93.56 v26.62,94.02 | v30.5,94 30.96,93.54 J10.A4_B9 | v26.6,88.3 27.58,88.3 D4.4 | R30.P$2 v17.5,84.2
  Bottom 0.2: v30.5,94 26.64,94 v26.62,94.02 26.62,88.32 v26.6,88.3 26.6,84.6 23.7,81.7 20,81.7 v17.5,84.2
VIN-SENSE  (via drill 0.3)
  Top 0.2: C7.P$1 R9.P$2 R8.P$1 v1.5,30 | v13.5,42.5 v46,42.5 | v61.5,41.5 62.5,41.5 65.7,44.7 65.7,50.3 65,51 64.3,51 63.3,52 62.78,52 62.42,52.36 U10.46
  Bottom 0.2: v1.5,30 2.5,31 2.5,39 2.3,39.2 2.3,39.8 5,42.5 v13.5,42.5 | v61.5,41.5 47,41.5 v46,42.5
WTIM1-CC1-ZERO-CROSS  (via drill 0.3)
  Top 0.2: 33.56,13.46 R28.P$1 | R28.P$1 33.52,17.02 36,19.5 36,38 39.79,41.79 46.55,41.79 46.91,42.15 46.91,44.01 53.6,50.7 v53.7,50.7 | v64.5,61.5 66.08,61.5 U10.64 | J8.P$2 33.64,13.38 R28.P$1
  Bottom 0.2: v53.7,50.7 v64.5,61.5
WTIM2-CC0-SERVO0-SIG  (via drill 0.3)
  Top 0.2: U10.49 63.92,52.08 64.4,51.6 v65.4,51.6 | v80,18 80.07,17.93 U5.2
  Bottom 0.2: v65.4,51.6 80.5,36.5 80.5,18.5 v80,18

### Text on the board
tPlace: SWD | RESET | R3FLOW HV2.0 / 1921 | zero cross | 12v | gnd | ssr out | gnd | gnd
bPlace: rx | tx